# EasyEDA Pro project Mixed PCB_1.eprj

# Schematic Part1

## Sheets
1 P1: Create Date: 2024-04-20; Page Name: P1; Project Name: Mixed PCB; Schematic Name: Part1; Update Date: 2024-04-20; Company: EasyEDA.com; Drawn: EasyEDA; Page Size: A4; Part Number: JLCPCB-002; Reviewed: EasyEDA; Version: V0.1
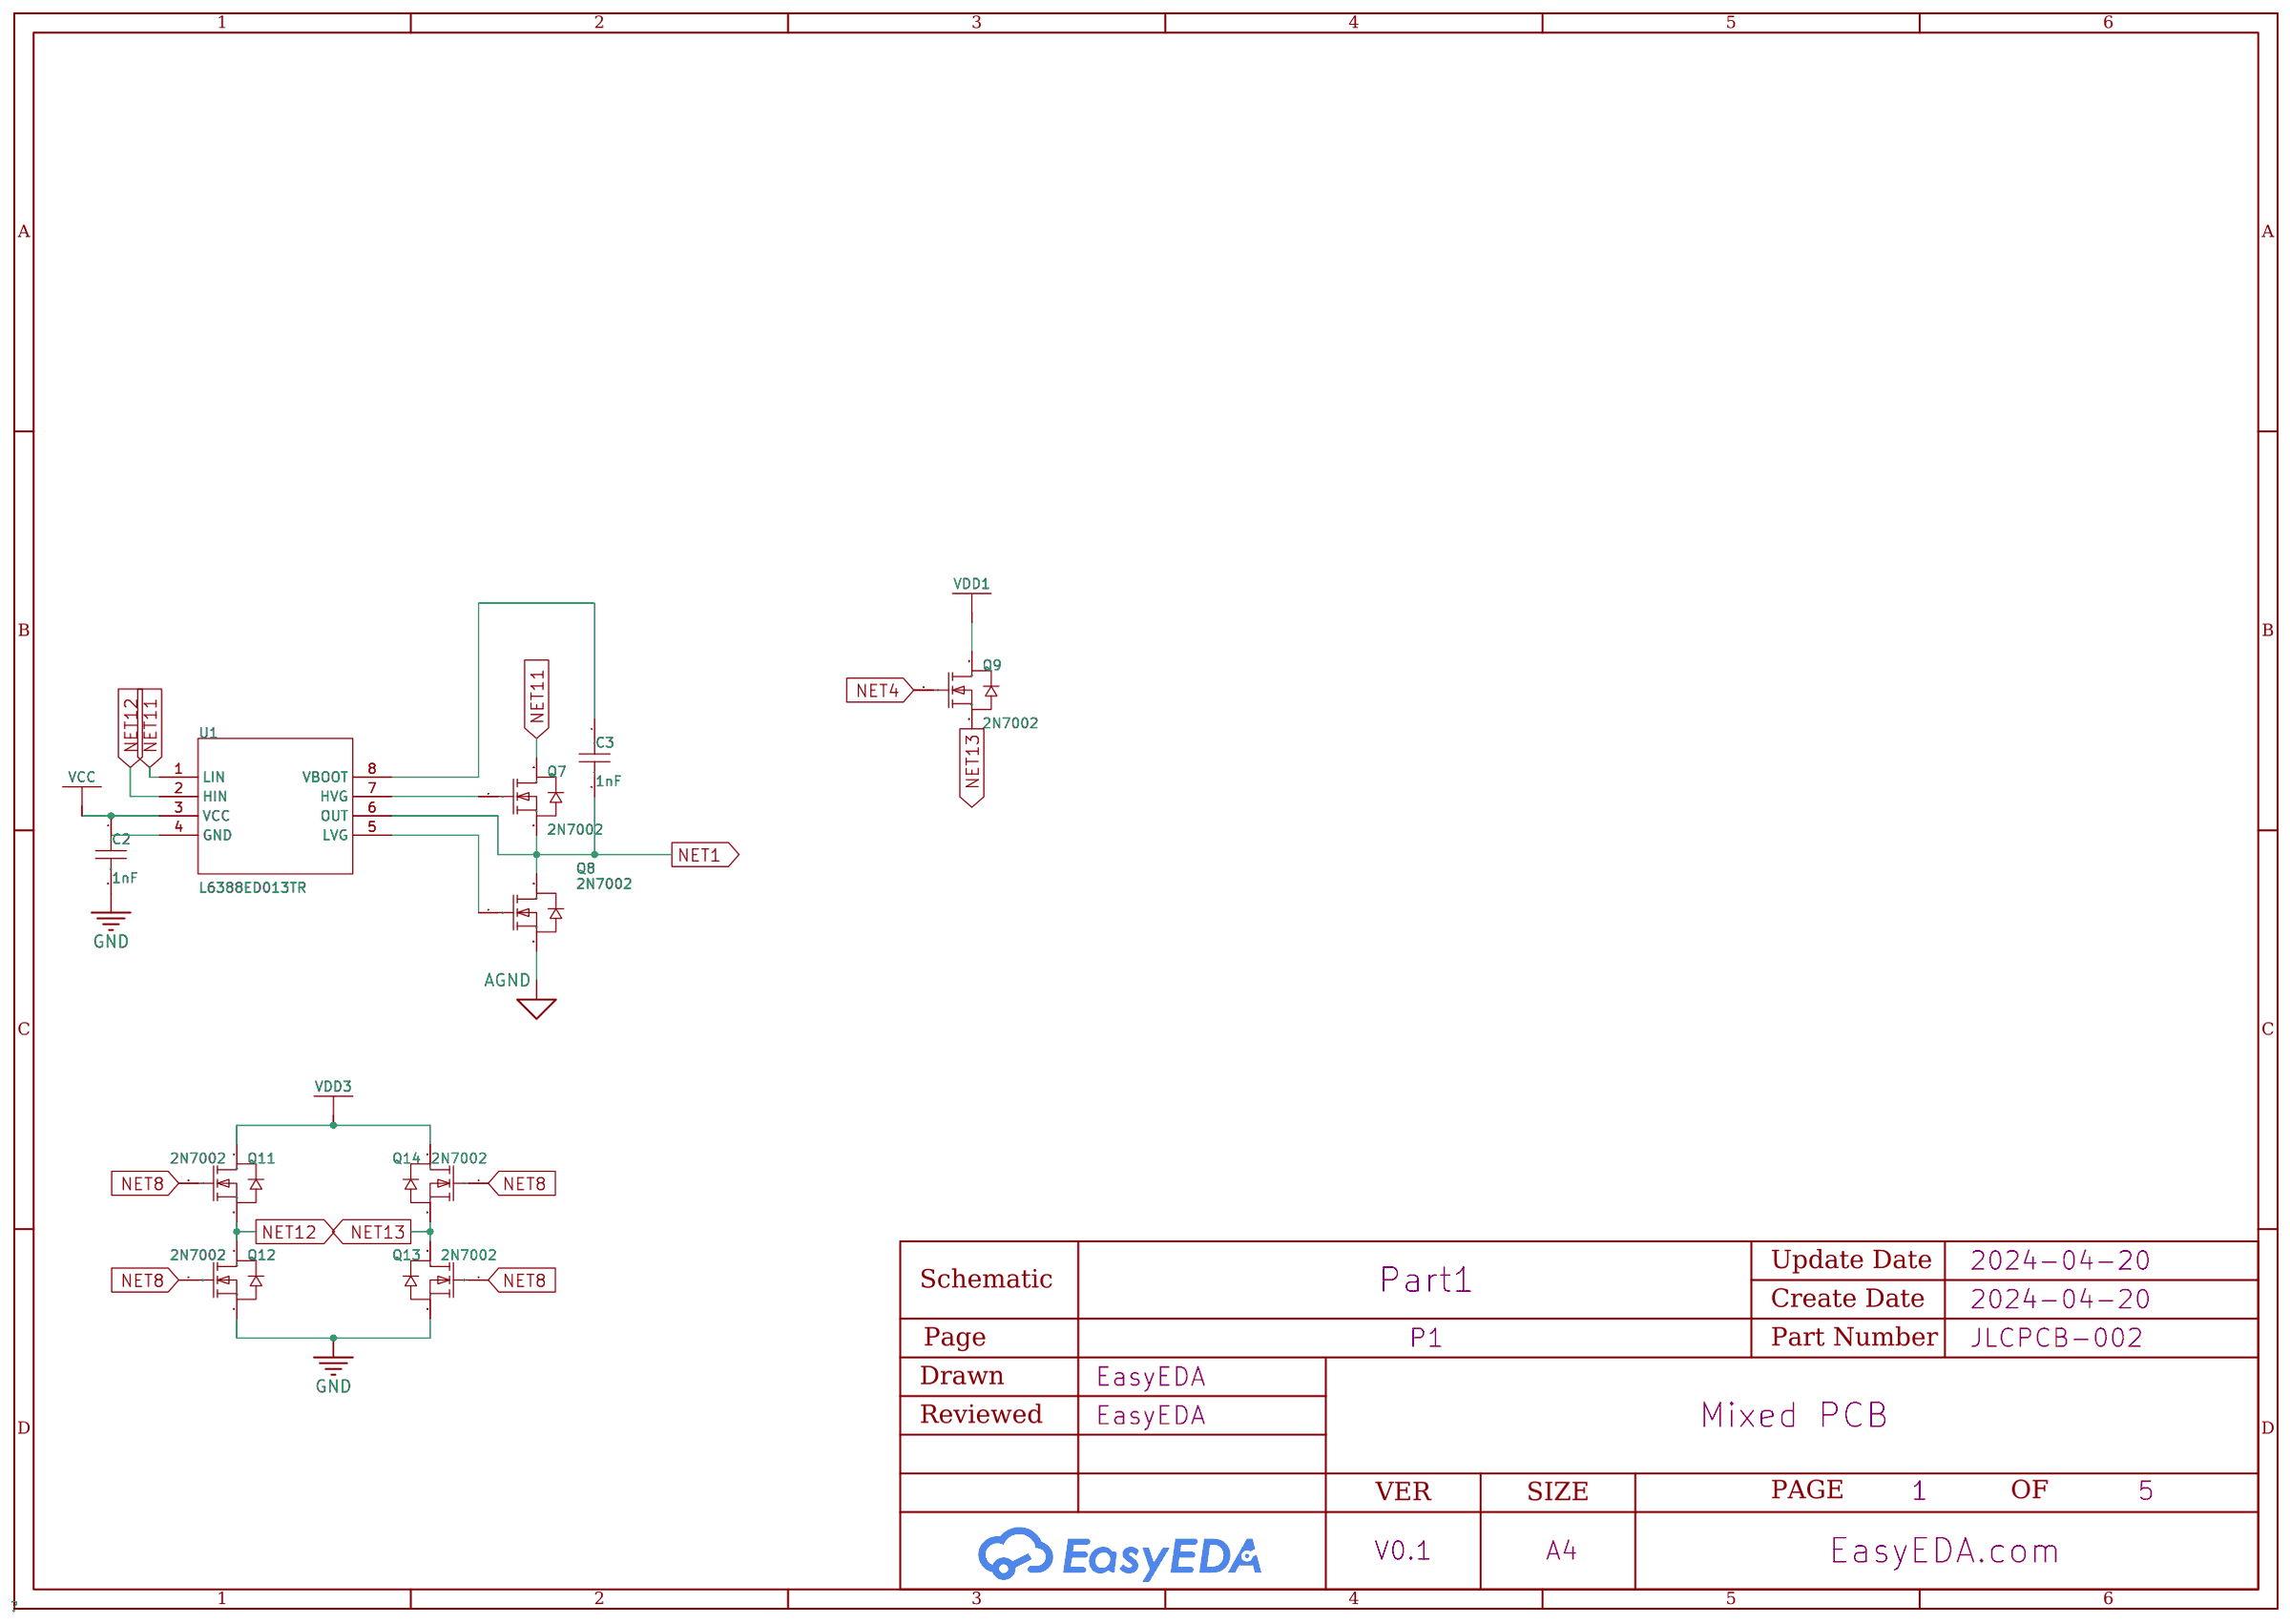
[diagram p0: P1]
2 P2: Page Name: P2
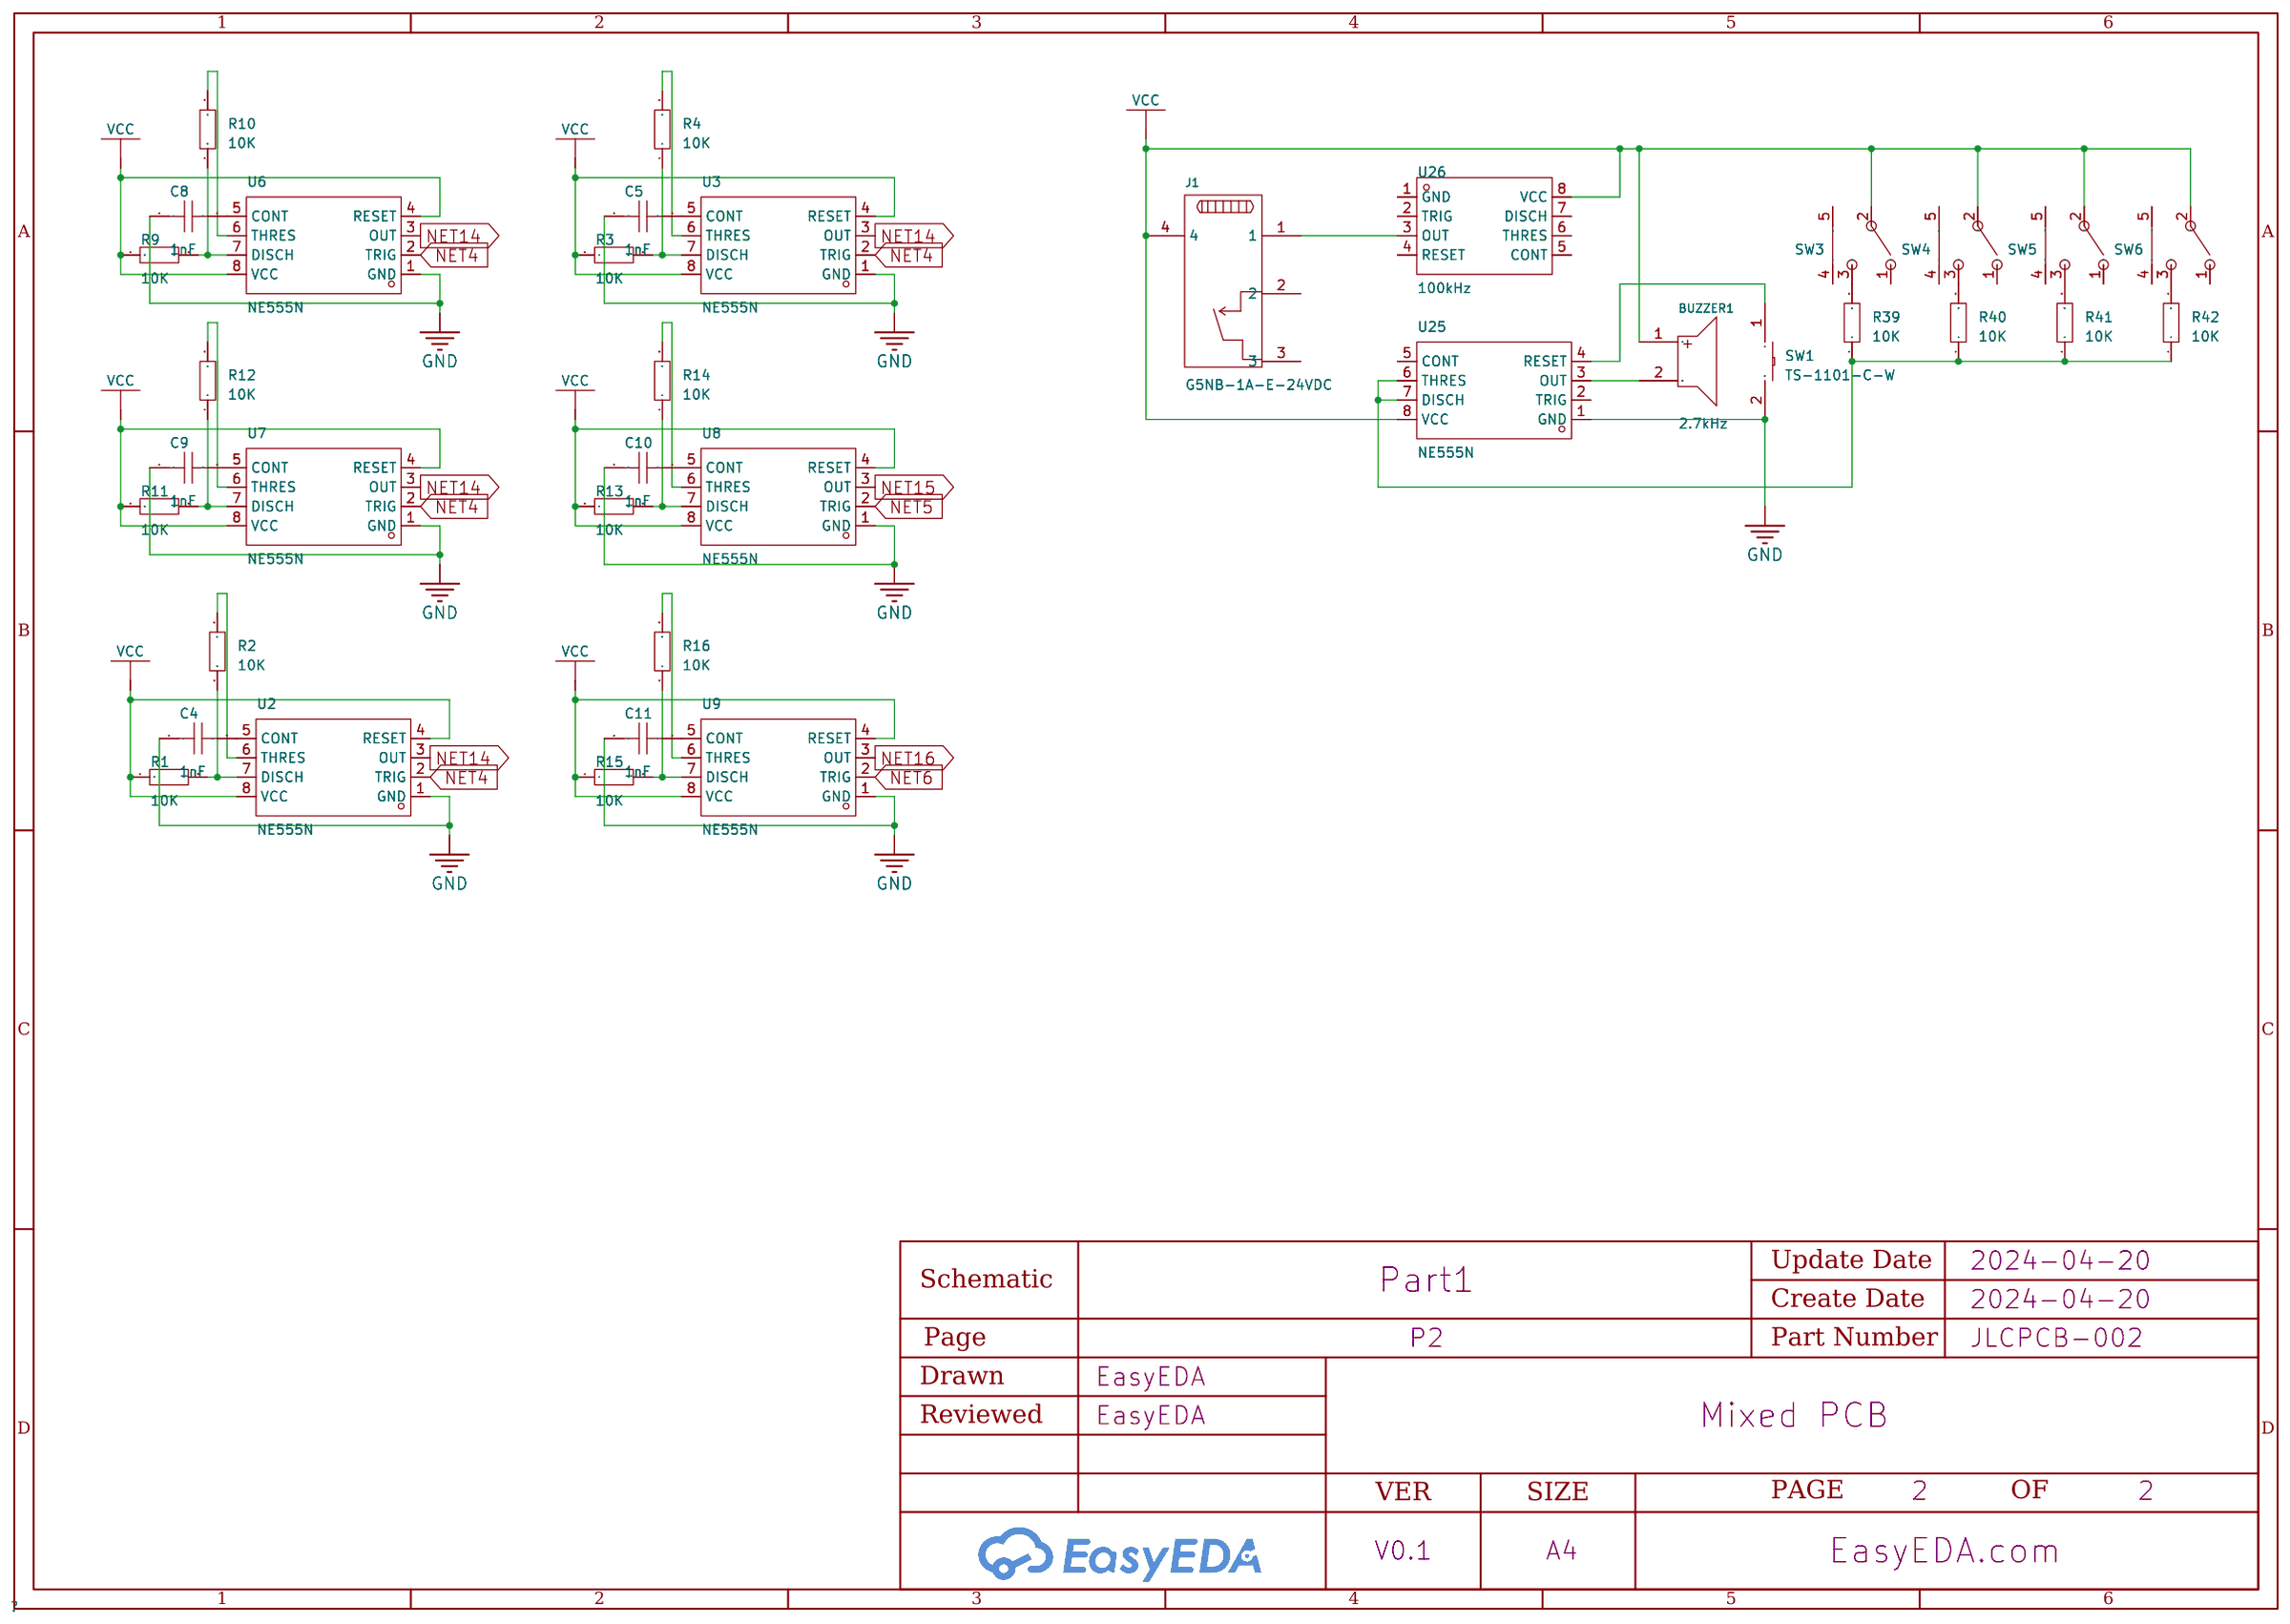
[diagram p1: P2]
3 P3: Page Name: P3
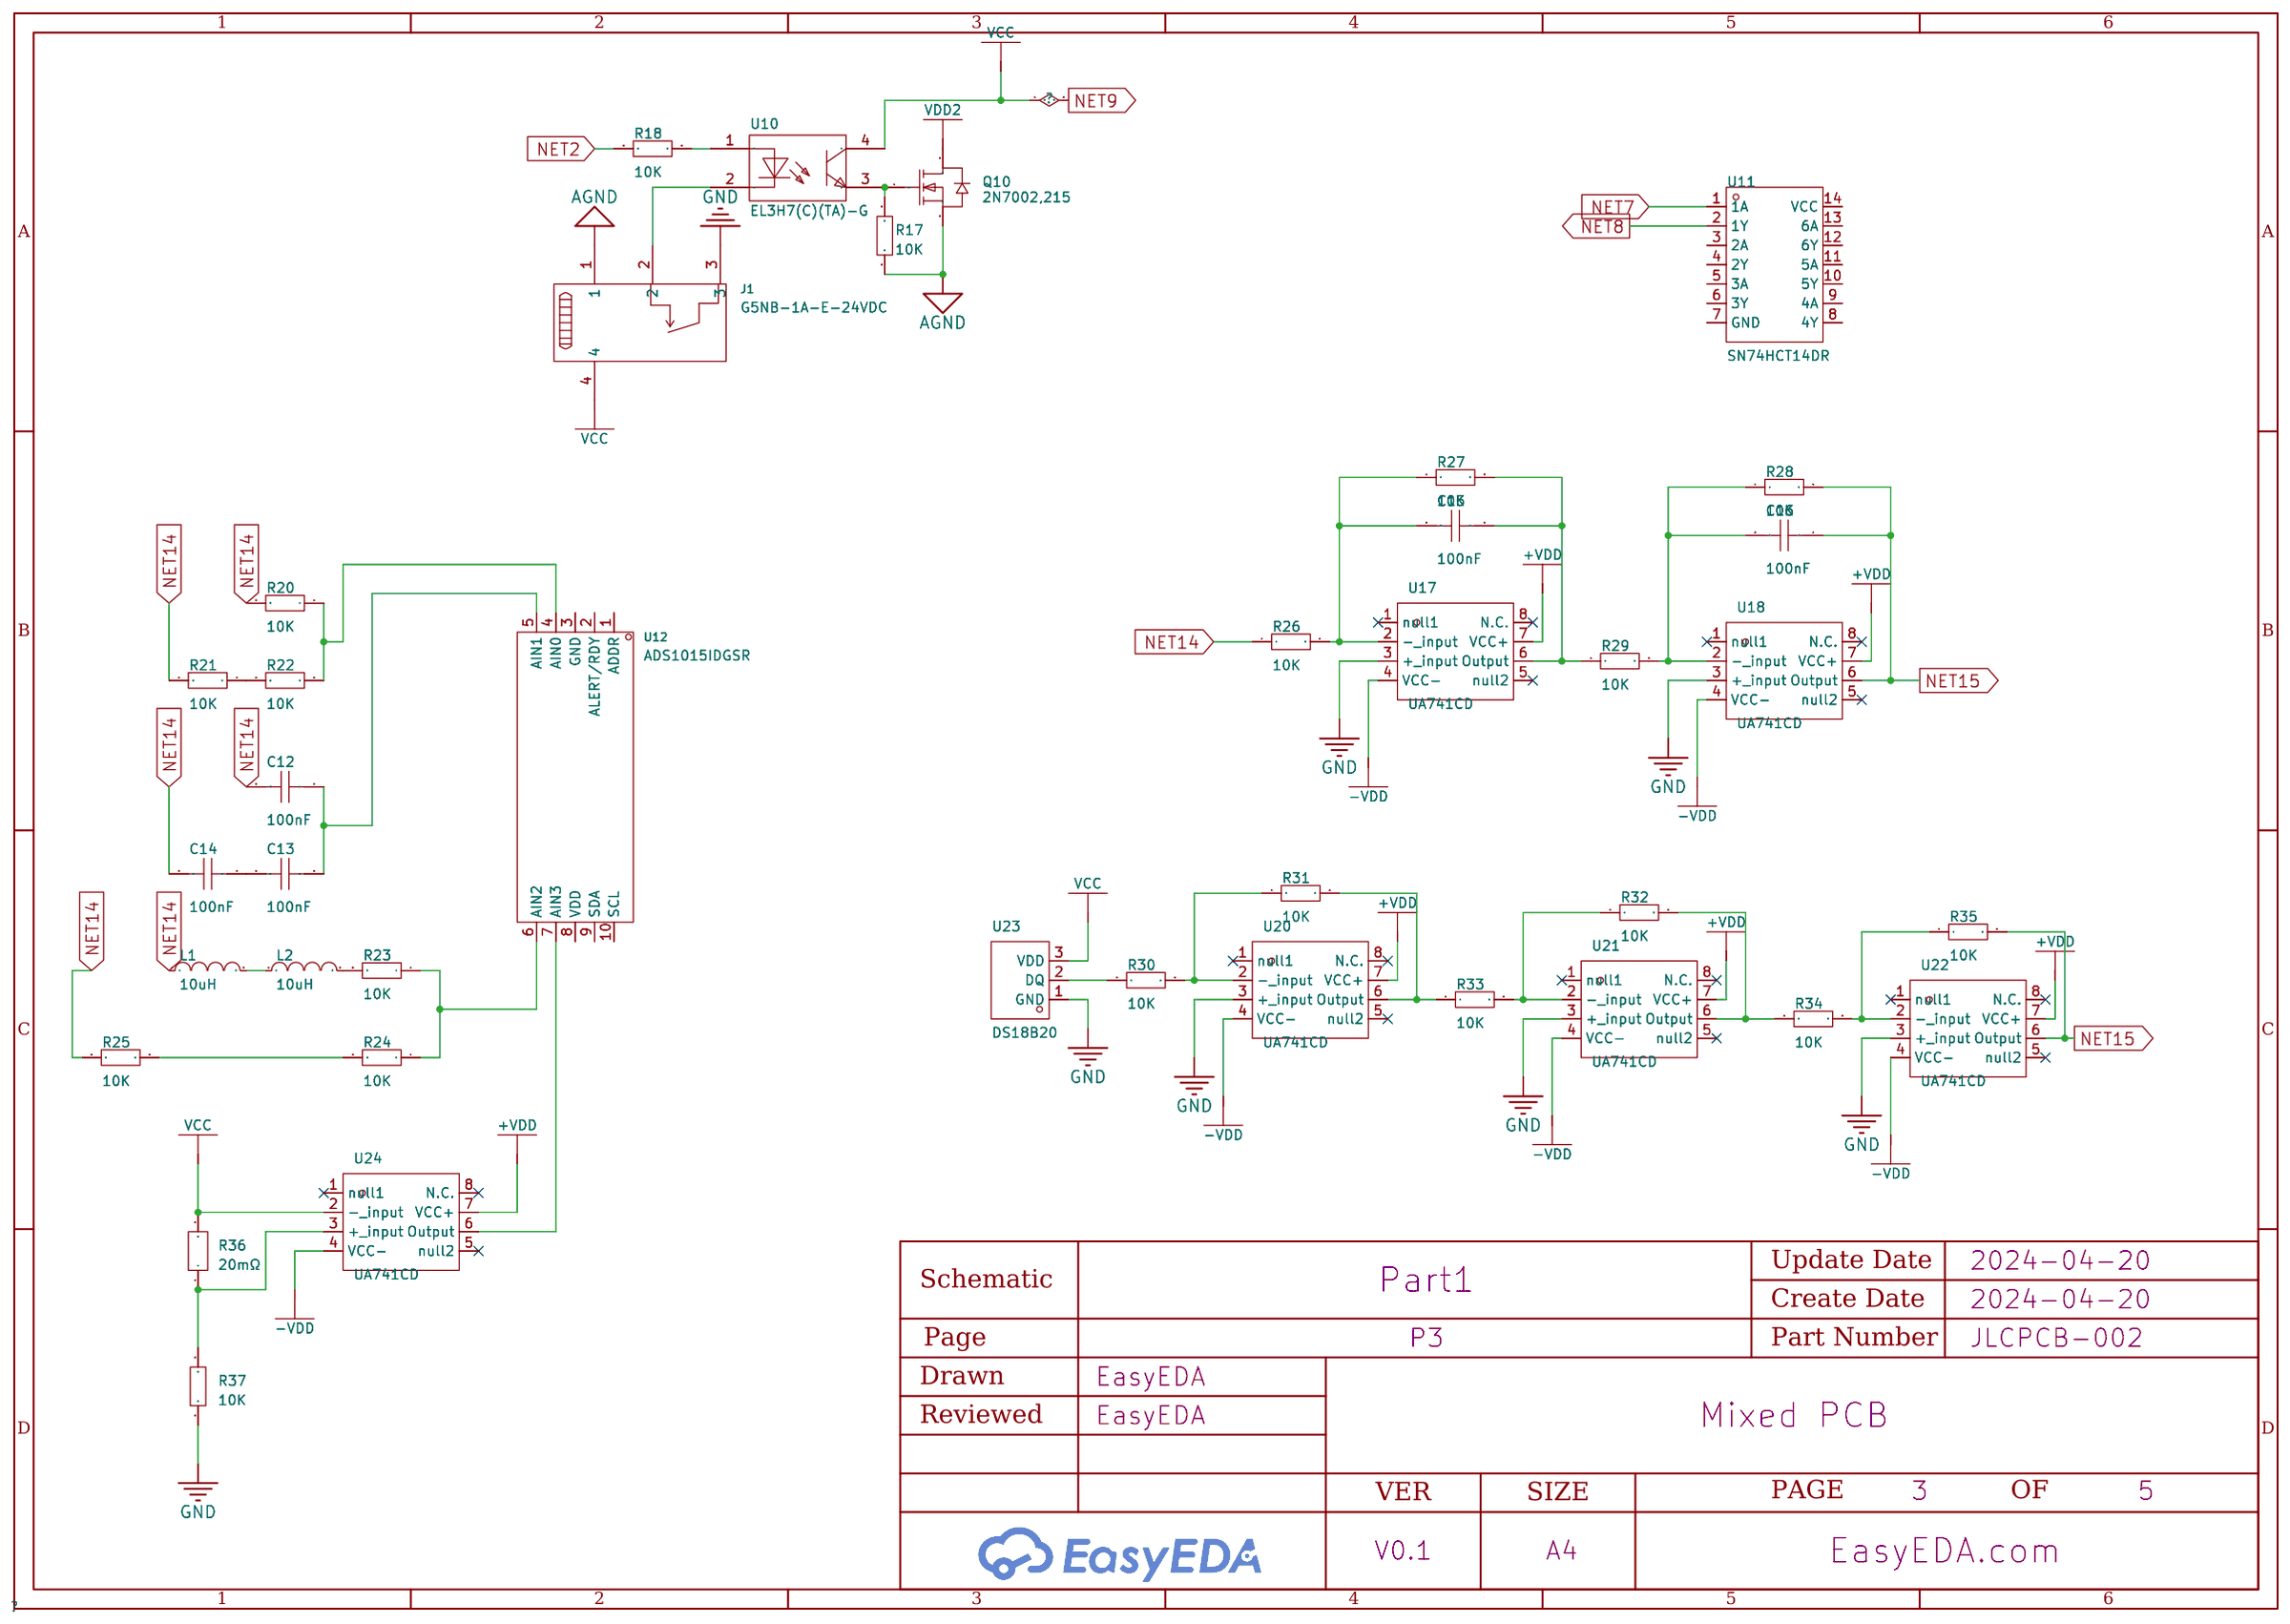
[diagram p2: P3]
4 P5: Page Name: P5.Part1; Update Date: 2024-04-24
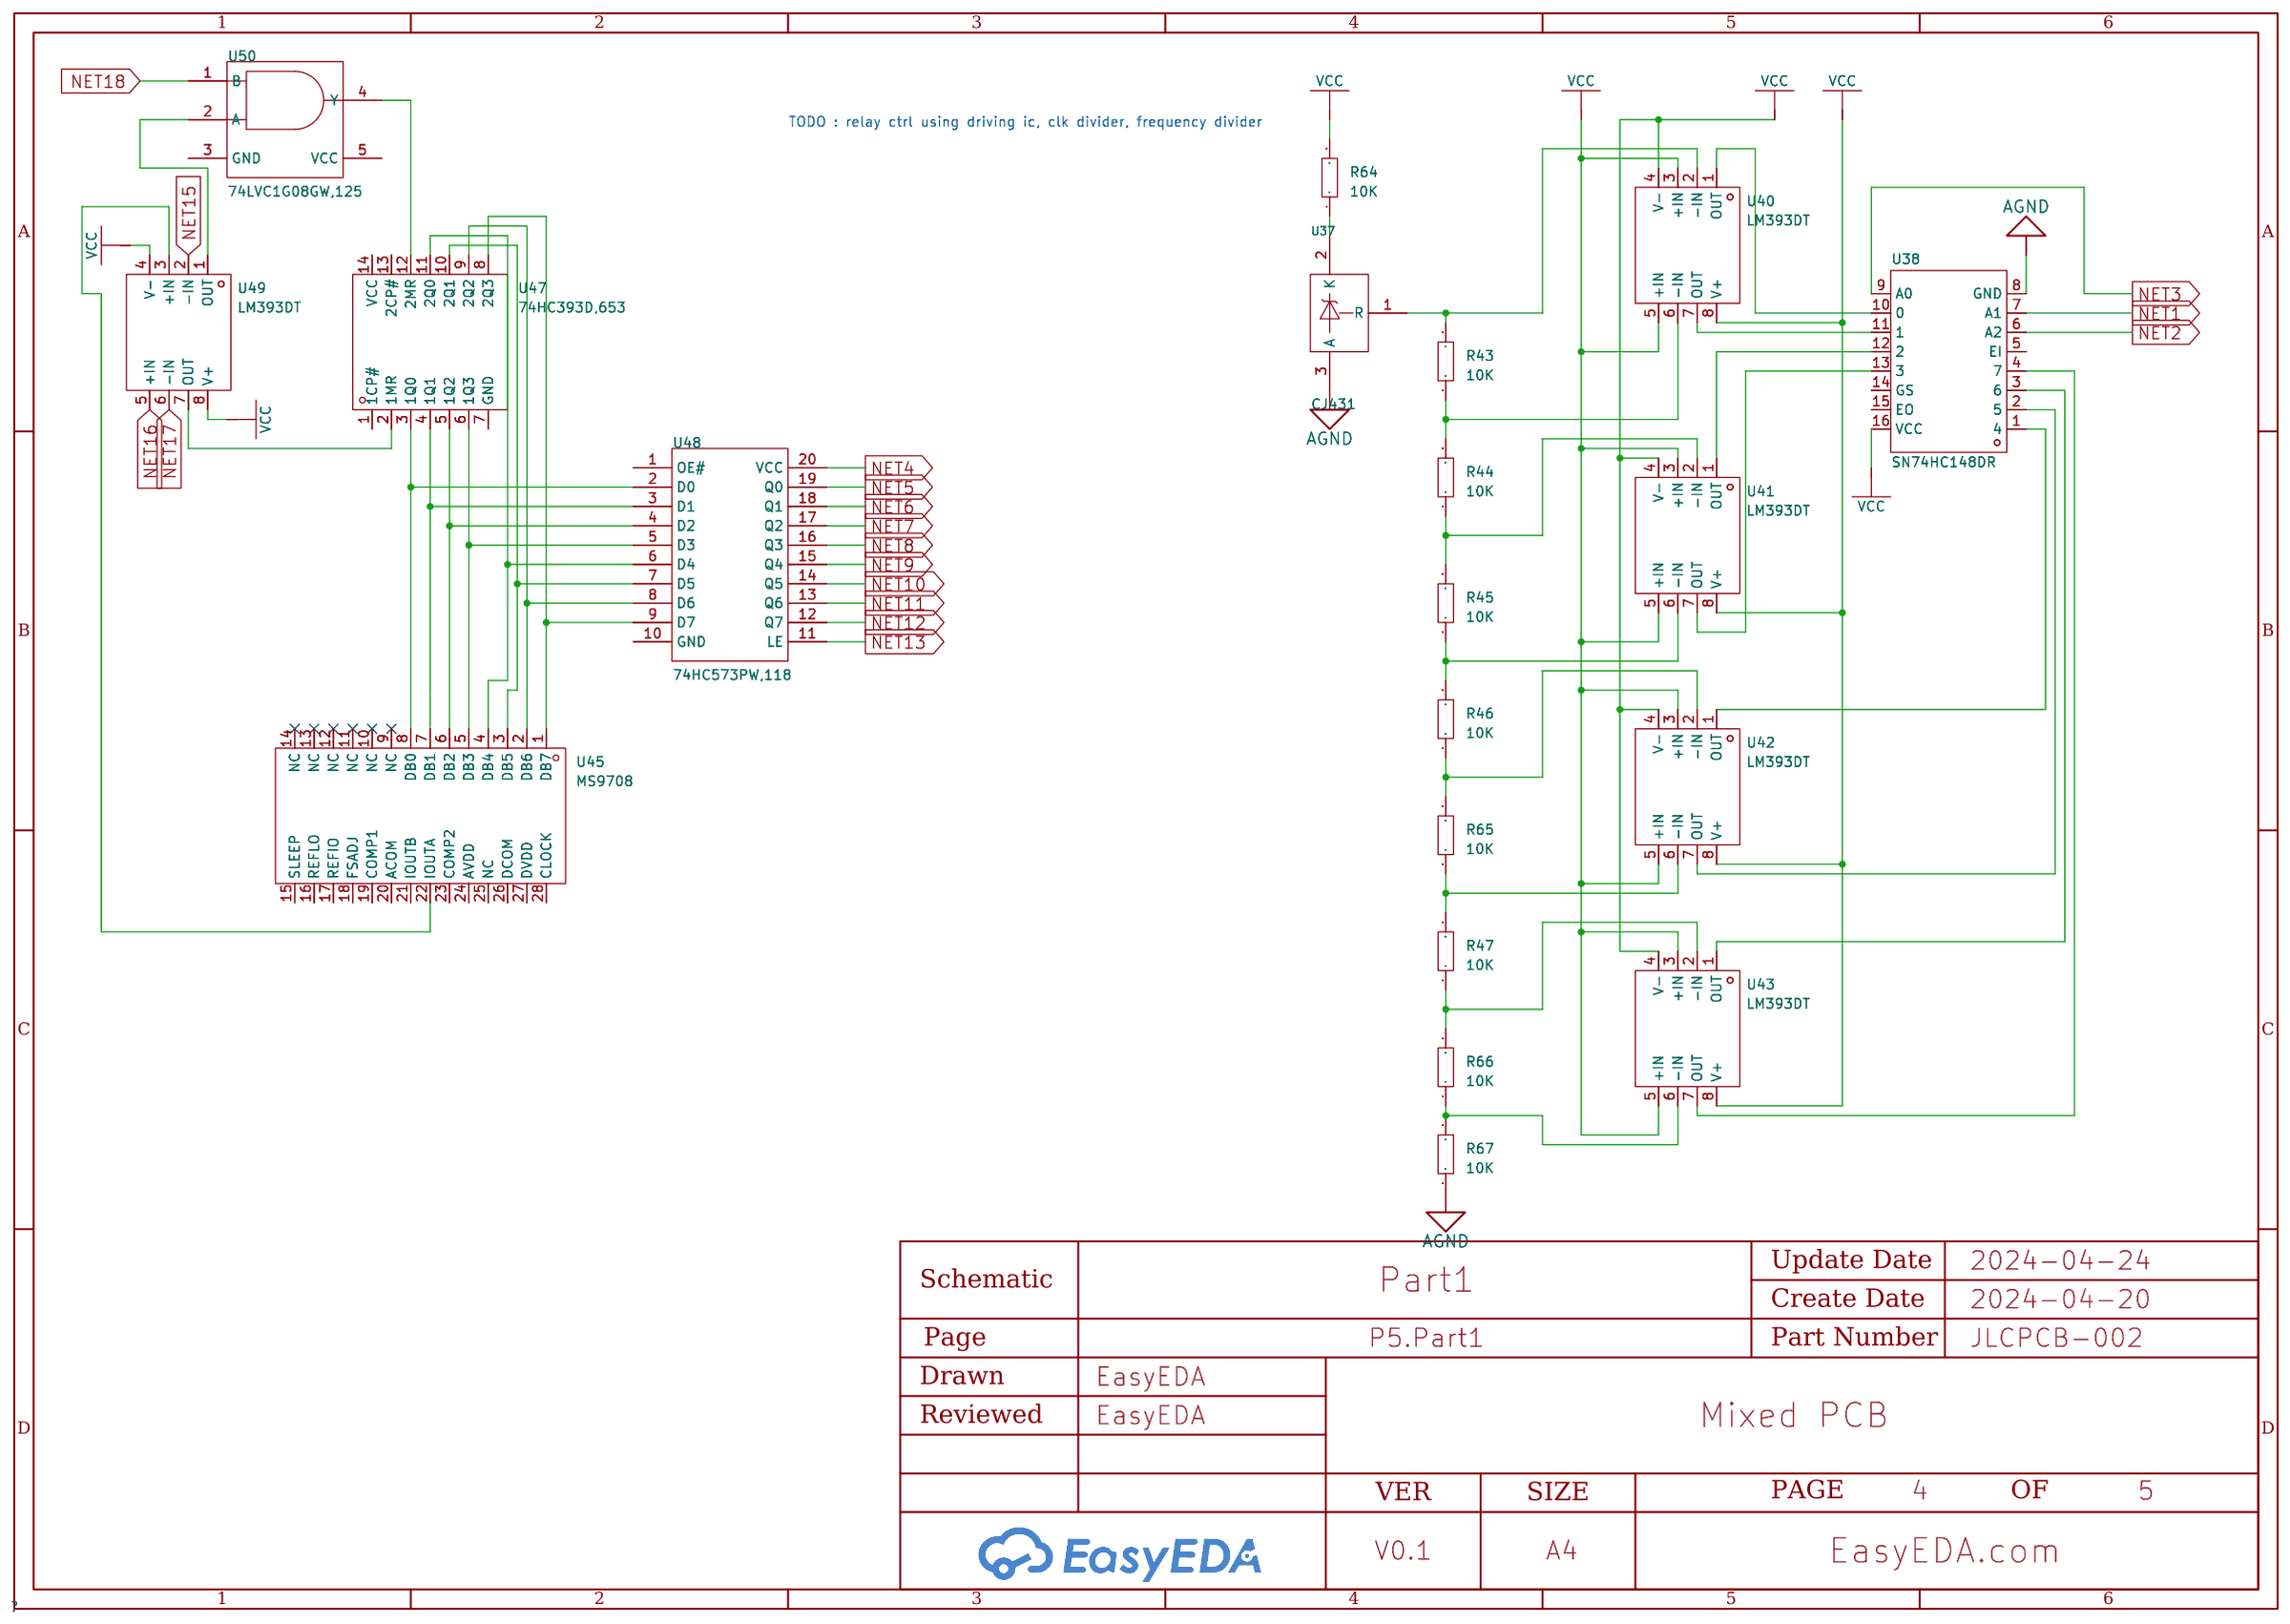
[diagram p3: P5]
5 P6: Create Date: 2024-04-23; Page Name: P6; Update Date: 2024-04-23
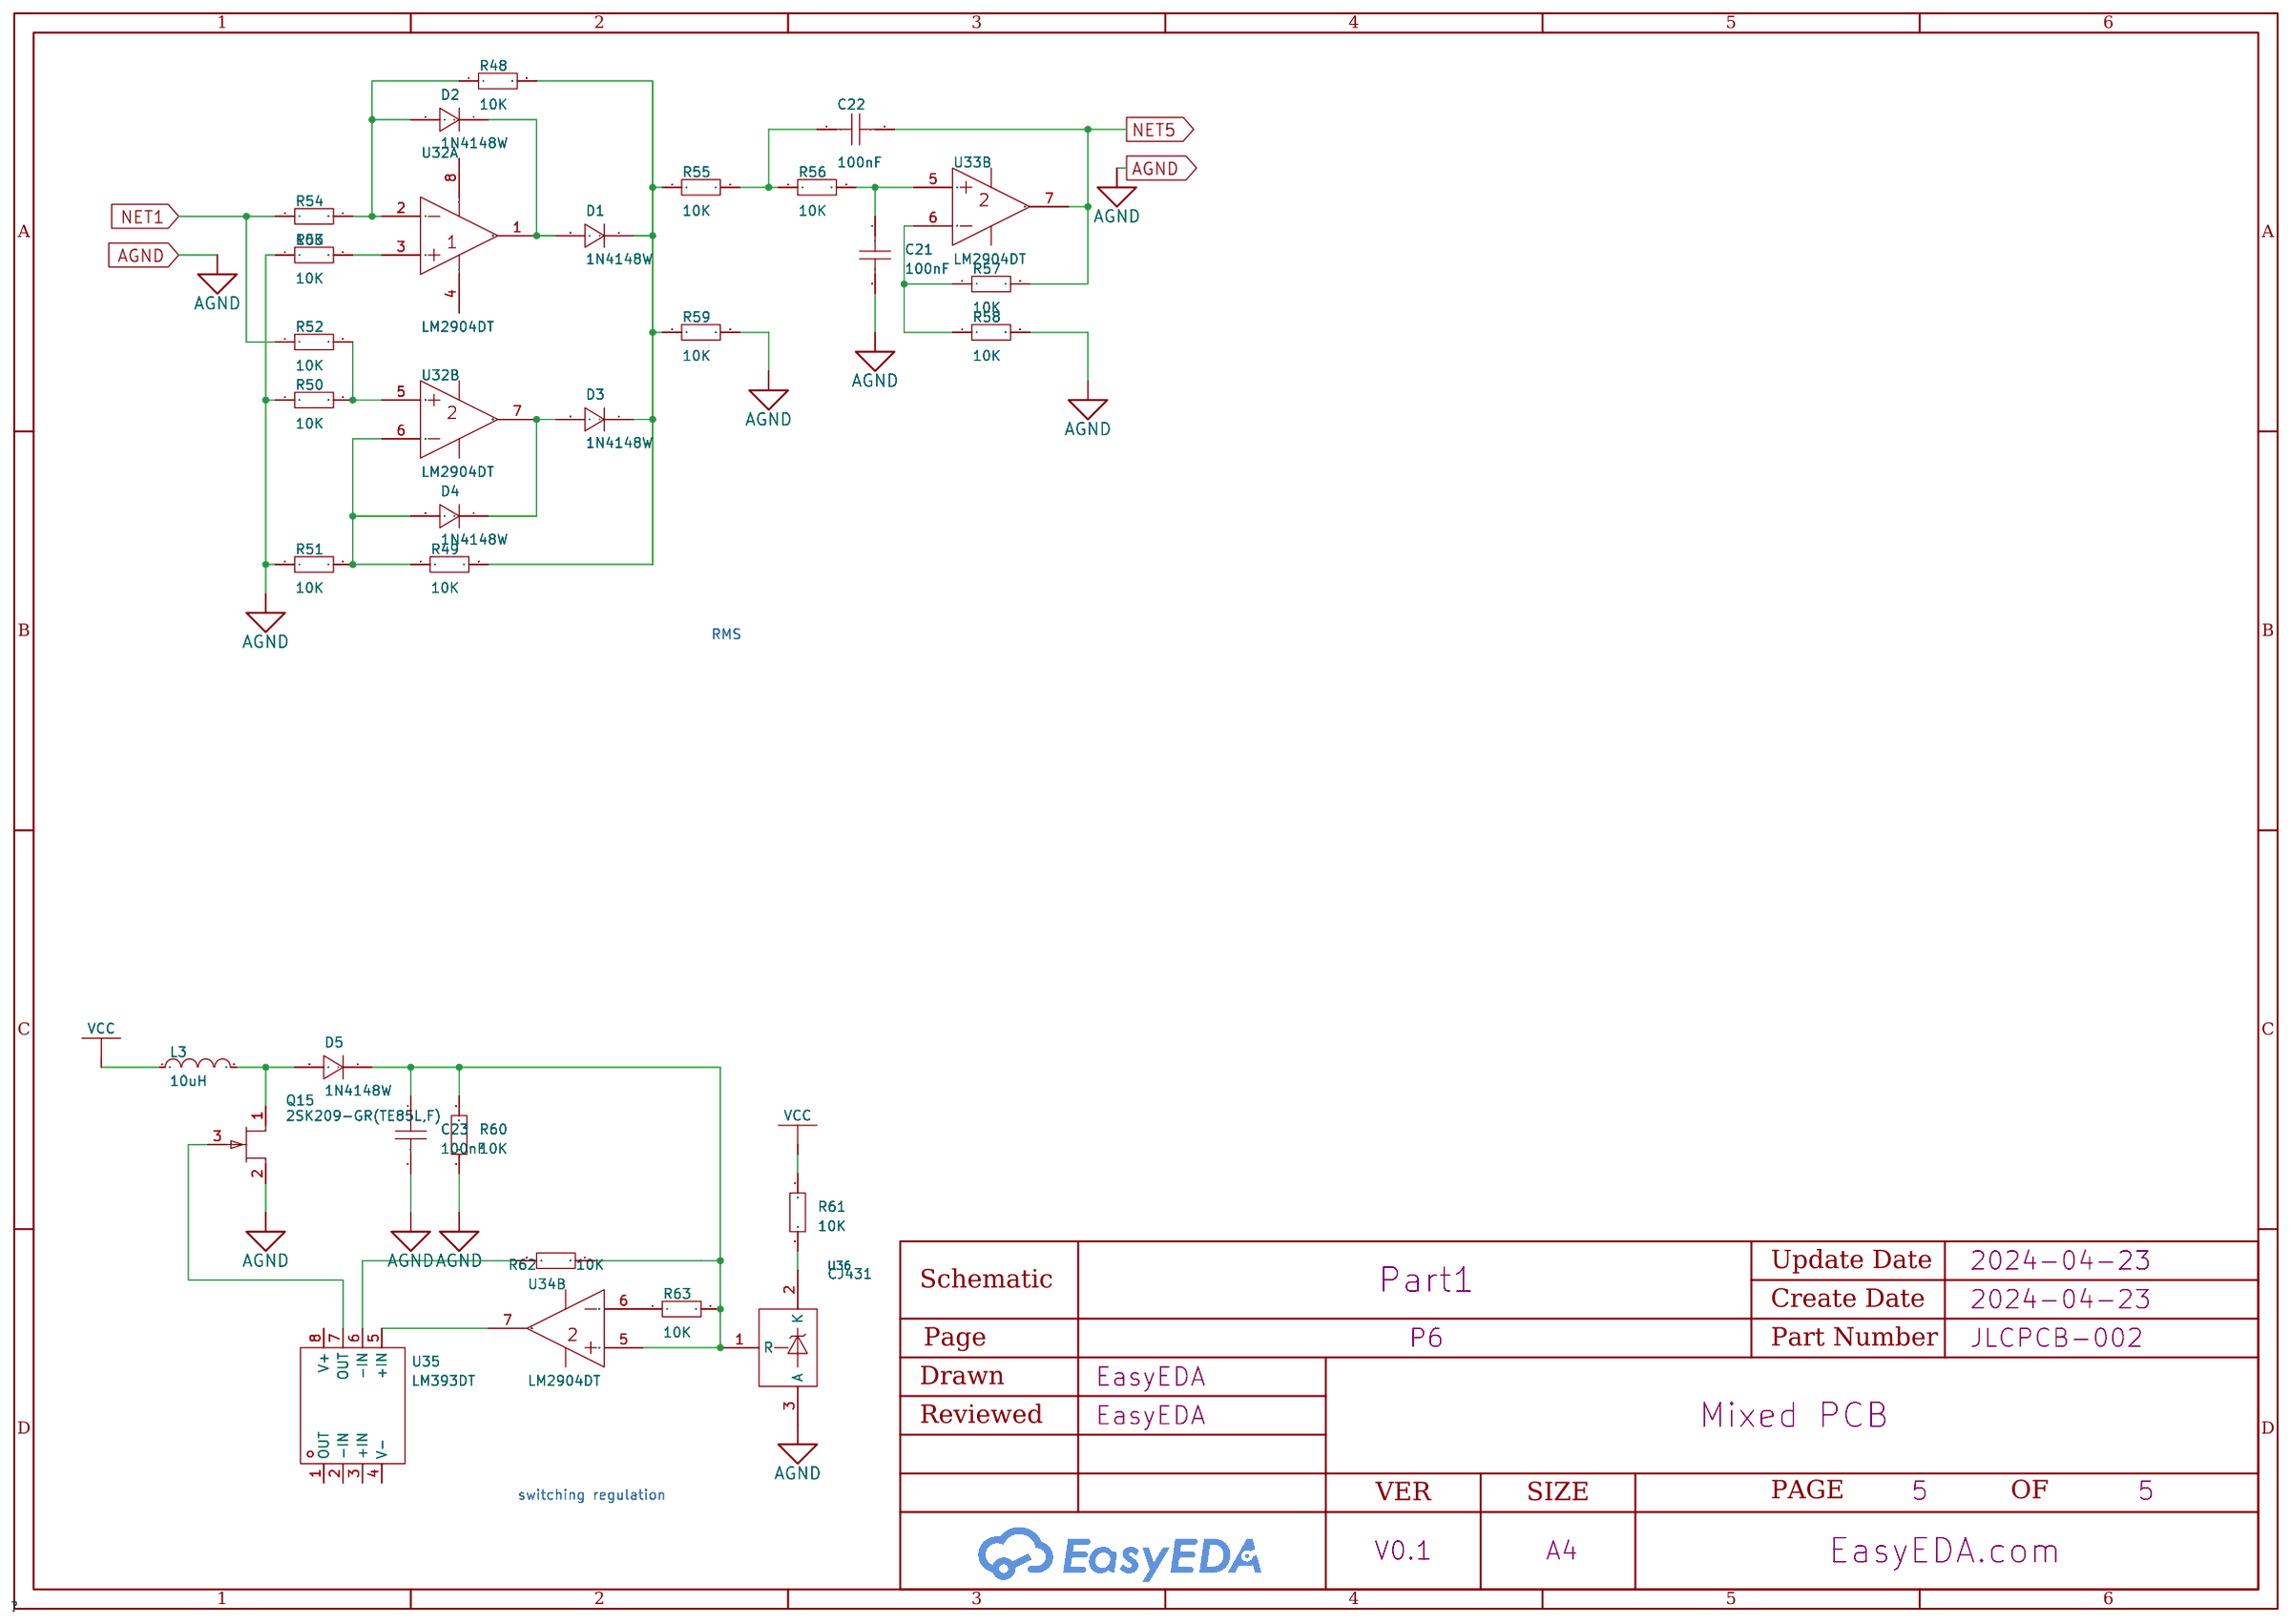
[diagram p4: P6]
6 P8: Create Date: 2024-04-26; Page Name: P8; Update Date: 2024-04-27
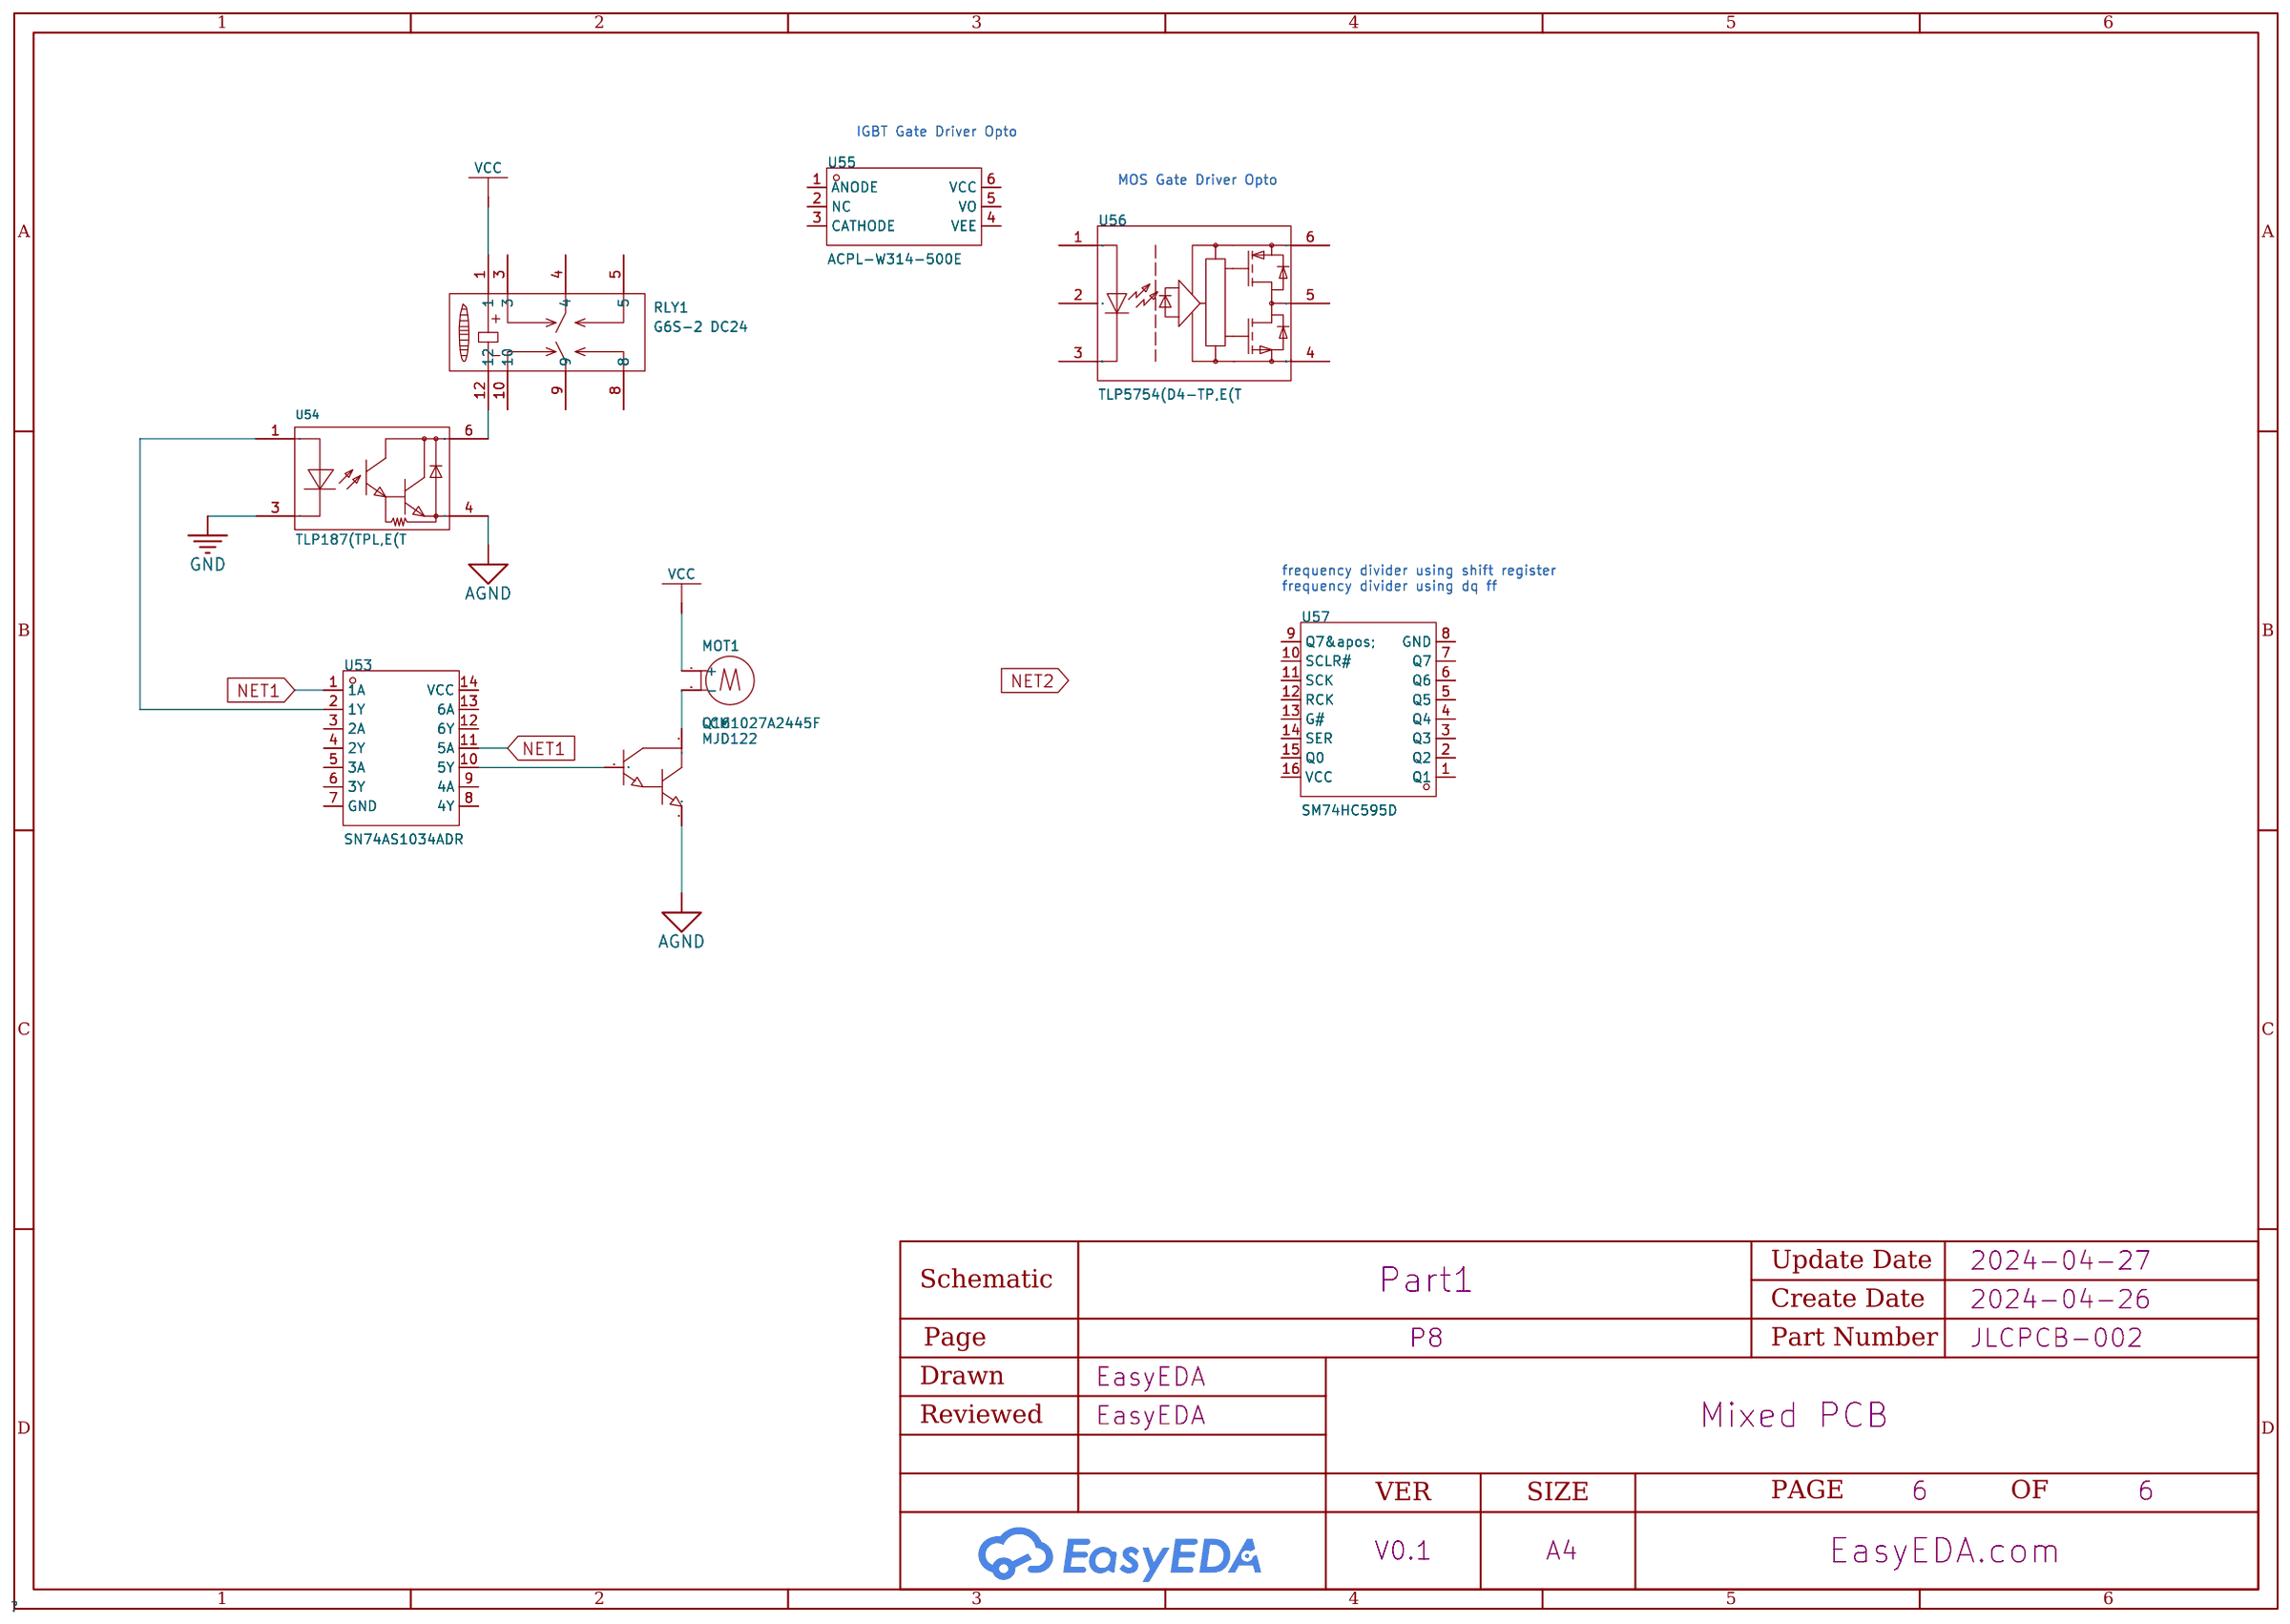
[diagram p5: P8]
7 P9: Create Date: 2024-04-28; Page Name: P9; Update Date: 2024-04-28
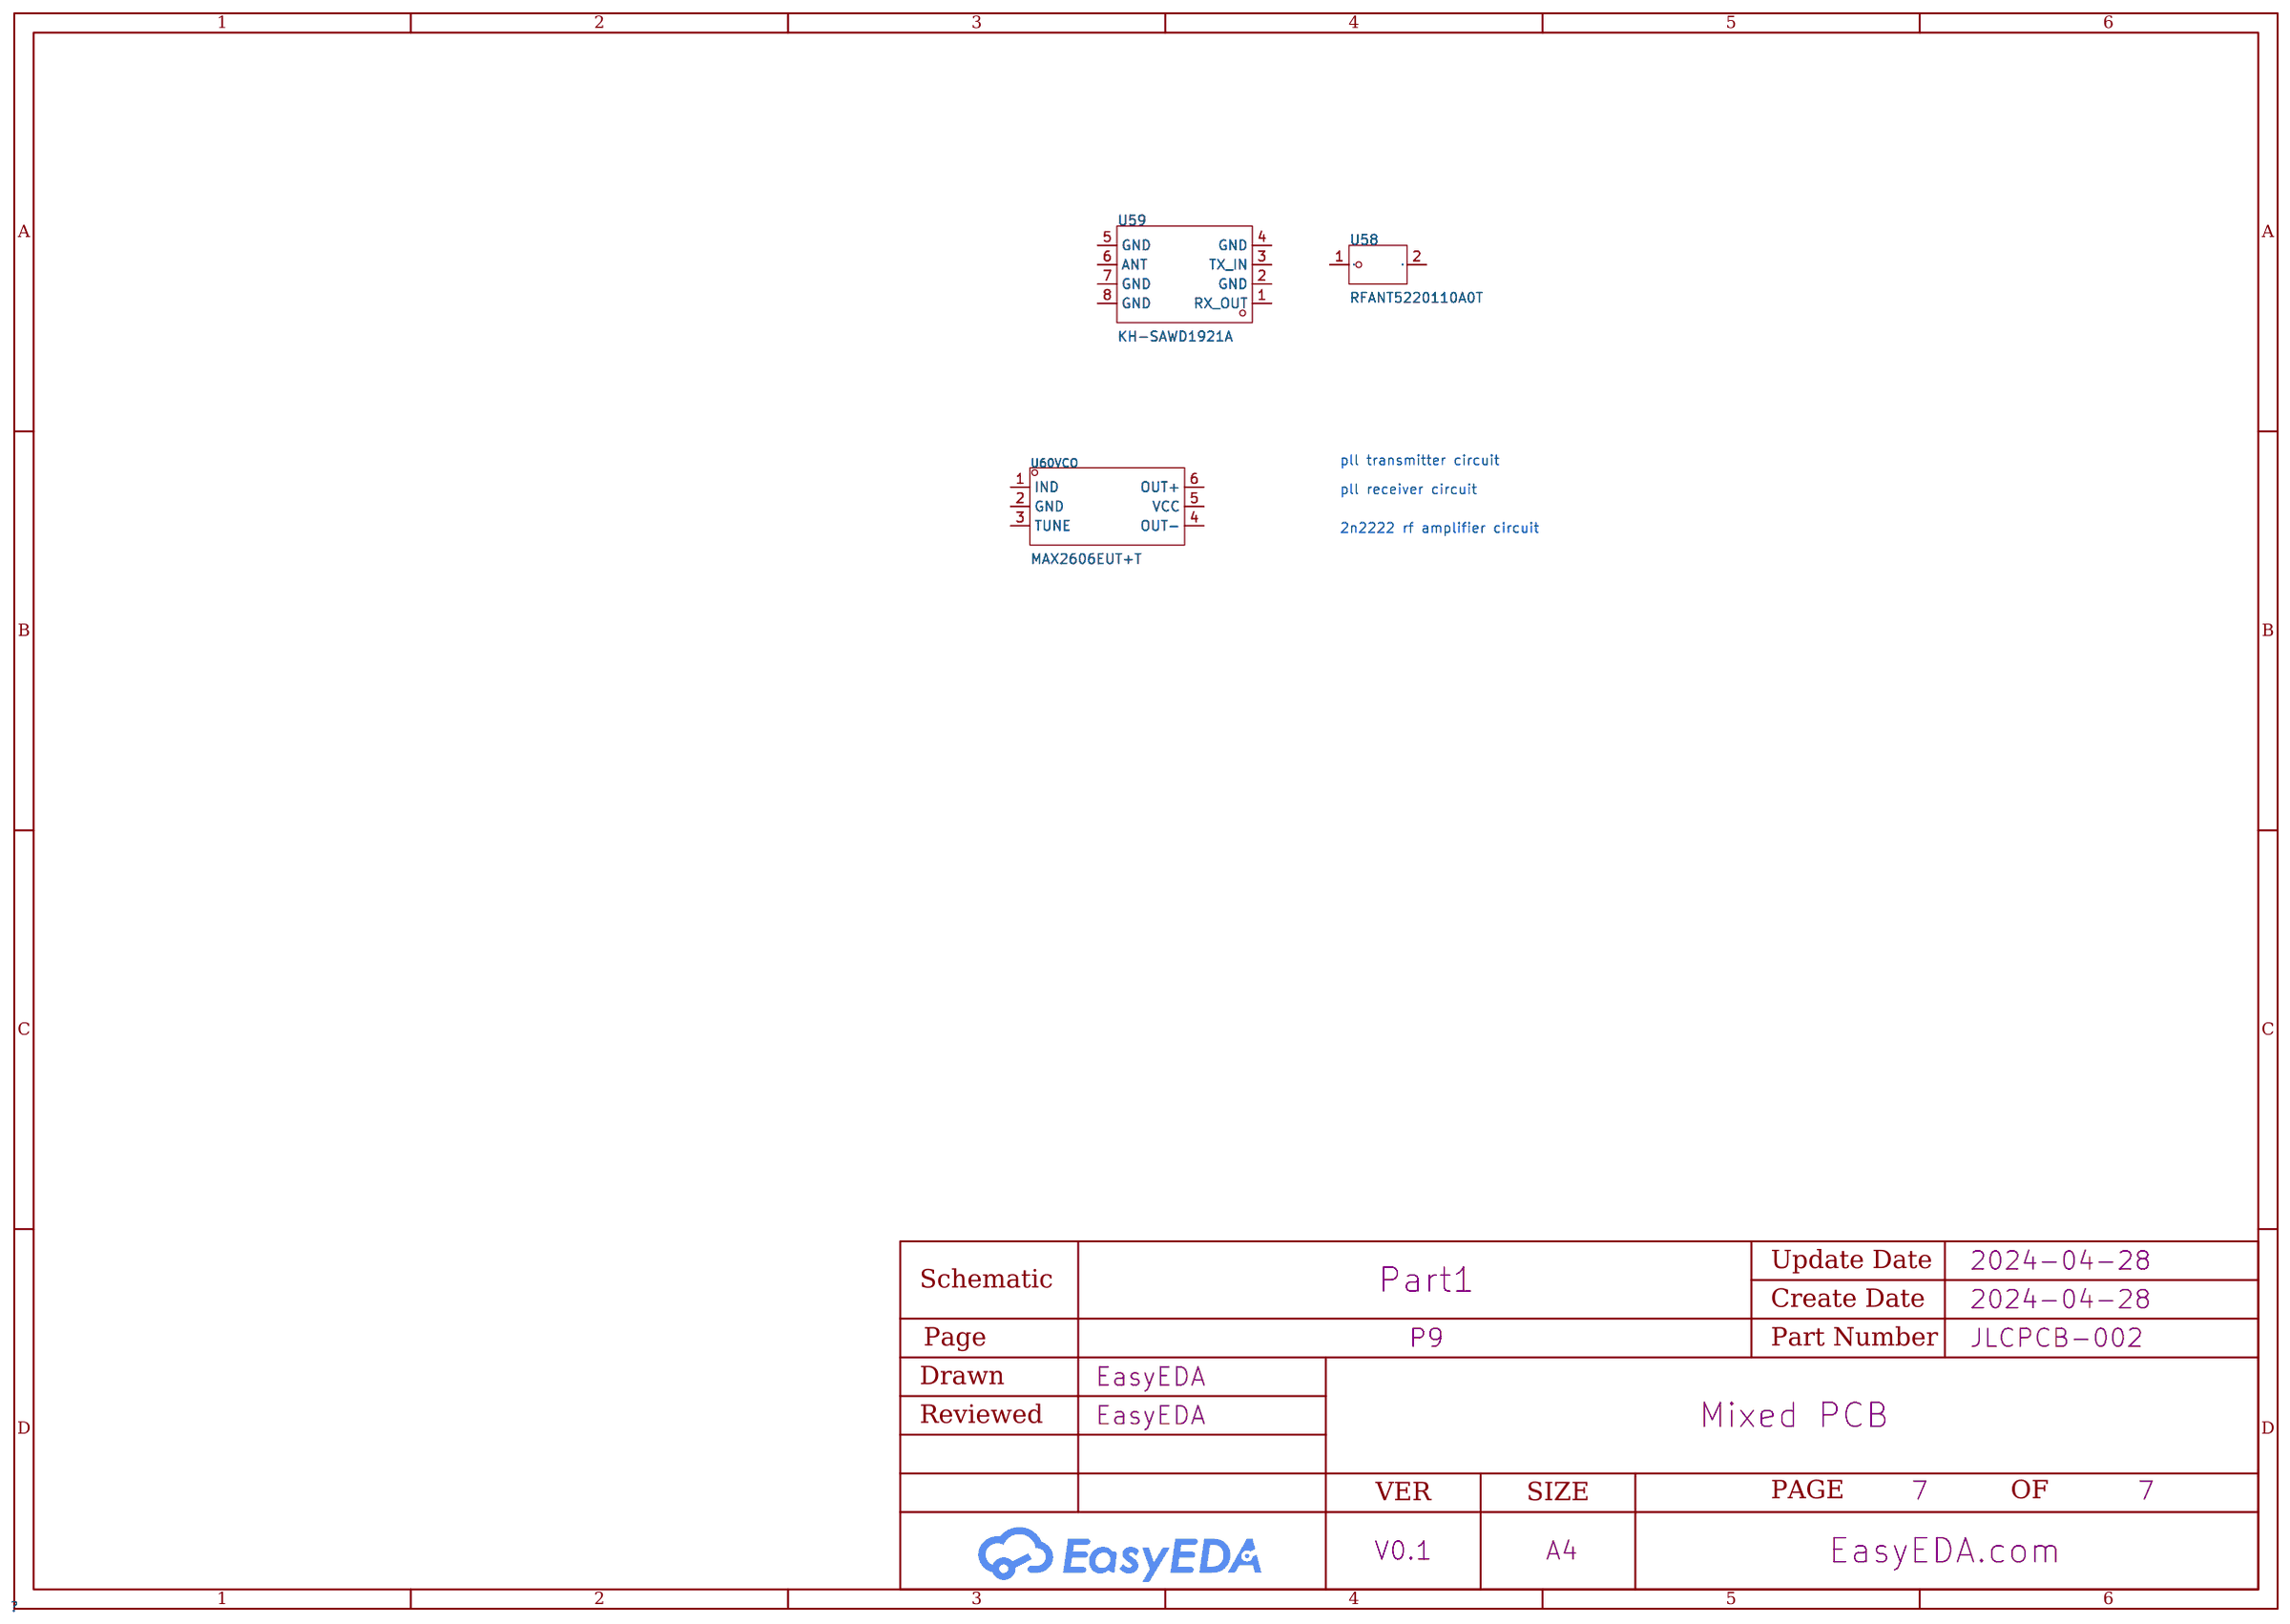
[diagram p6: P9]

## Parts
sheet P1
C2  1nF  [C0603]
C3  1nF  [C0603]
Q7  2N7002  [SOT-23-3_L2.9-W1.3-P1.90-LS2.4-BR]
Q8  2N7002  [SOT-23-3_L2.9-W1.3-P1.90-LS2.4-BR]
Q9  2N7002  [SOT-23-3_L2.9-W1.3-P1.90-LS2.4-BR]
Q11  2N7002  [SOT-23-3_L2.9-W1.3-P1.90-LS2.4-BR]
Q12  2N7002  [SOT-23-3_L2.9-W1.3-P1.90-LS2.4-BR]
Q13  2N7002  [SOT-23-3_L2.9-W1.3-P1.90-LS2.4-BR]
Q14  2N7002  [SOT-23-3_L2.9-W1.3-P1.90-LS2.4-BR]
U1  L6388ED013TR  [SOIC-8_L5.0-W4.0-P1.27-LS6.0-BL]
sheet P2
BUZZER1  2.7kHz  [BUZ-TH_BD9.0-P4.00-D0.6-FD]
C4  1nF  [C0603]
C5  1nF  [C0603]
C8  1nF  [C0603]
C9  1nF  [C0603]
C10  1nF  [C0603]
C11  1nF  [C0603]
J1  G5NB-1A-E-24VDC  [RELAY-TH_G5NB-1A-E-24VDC]
R1  10K  [R0603]
R2  10K  [R0603]
R3  10K  [R0603]
R4  10K  [R0603]
R9  10K  [R0603]
R10  10K  [R0603]
R11  10K  [R0603]
R12  10K  [R0603]
R13  10K  [R0603]
R14  10K  [R0603]
R15  10K  [R0603]
R16  10K  [R0603]
R39  10K  [R0603]
R40  10K  [R0603]
R41  10K  [R0603]
R42  10K  [R0603]
SW1  TS-1101-C-W  [SW-SMD_L6.0-W3.3-LS8.0]
SW3  ST-0-102-C03-N003-RS  [SW-TH_ST-0-102-C03-N003-RS]
SW4  ST-0-102-C03-N003-RS  [SW-TH_ST-0-102-C03-N003-RS]
SW5  ST-0-102-C03-N003-RS  [SW-TH_ST-0-102-C03-N003-RS]
SW6  ST-0-102-C03-N003-RS  [SW-TH_ST-0-102-C03-N003-RS]
U2  NE555N  [DIP-8_L9.8-W6.6-P2.54-LS7.6-BL]
U3  NE555N  [DIP-8_L9.8-W6.6-P2.54-LS7.6-BL]
U6  NE555N  [DIP-8_L9.8-W6.6-P2.54-LS7.6-BL]
U7  NE555N  [DIP-8_L9.8-W6.6-P2.54-LS7.6-BL]
U8  NE555N  [DIP-8_L9.8-W6.6-P2.54-LS7.6-BL]
U9  NE555N  [DIP-8_L9.8-W6.6-P2.54-LS7.6-BL]
U25  NE555N  [DIP-8_L9.8-W6.6-P2.54-LS7.6-BL]
U26  100kHz  [DIP-8_L9.8-W6.6-P2.54-LS7.6-BL]
sheet P3
C12  100nF  [C0603]
C13  100nF  [C0603]
C14  100nF  [C0603]
C15  100nF  [C0603]
C16  100nF  [C0603]
J1#2  G5NB-1A-E-24VDC  [RELAY-TH_G5NB-1A-E-24VDC]
L1  10uH  [L0603]
L2  10uH  [L0603]
Q10  2N7002,215  [SOT-23_L2.9-W1.3-P1.90-LS2.4-BR]
R17  10K  [R0603]
R18  10K  [R0603]
R20  10K  [R0603]
R21  10K  [R0603]
R22  10K  [R0603]
R23  10K  [R0603]
R24  10K  [R0603]
R25  10K  [R0603]
R26  10K  [R0603]
R27  10K  [R0603]
R28  10K  [R0603]
R29  10K  [R0603]
R30  10K  [R0603]
R31  10K  [R0603]
R32  10K  [R0603]
R33  10K  [R0603]
R34  10K  [R0603]
R35  10K  [R0603]
R36  20mΩ  [R1206]
R37  10K  [R0603]
U10  EL3H7(C)(TA)-G  [SMD-4_L2.7-W4.4-P1.27-LS7.0-BL]
U11  SN74HCT14DR  [SOIC-14_L8.7-W3.9-P1.27-LS6.0-BL]
U12  ADS1015IDGSR  [VSSOP-10_L3.0-W3.0-P0.50-LS4.9-BL]
U17  UA741CD  [SO-8_L4.9-W3.9-P1.27-LS6.0-BL]
U18  UA741CD  [SO-8_L4.9-W3.9-P1.27-LS6.0-BL]
U20  UA741CD  [SO-8_L4.9-W3.9-P1.27-LS6.0-BL]
U21  UA741CD  [SO-8_L4.9-W3.9-P1.27-LS6.0-BL]
U22  UA741CD  [SO-8_L4.9-W3.9-P1.27-LS6.0-BL]
U23  DS18B20  [TO-92-3_L4.9-W3.7-P1.27-L]
U24  UA741CD  [SO-8_L4.9-W3.9-P1.27-LS6.0-BL]
sheet P5
R43  10K  [R0603]
R44  10K  [R0603]
R45  10K  [R0603]
R46  10K  [R0603]
R47  10K  [R0603]
R64  10K  [R0603]
R65  10K  [R0603]
R66  10K  [R0603]
R67  10K  [R0603]
U37  CJ431  [SOT-23-3_L2.9-W1.6-P1.90-LS2.8-BR]
U38  SN74HC148DR  [SOIC-16_L9.9-W3.9-P1.27-LS6.0-BL]
U40  LM393DT  [SOIC-8_L5.0-W4.0-P1.27-LS6.0-BL]
U41  LM393DT  [SOIC-8_L5.0-W4.0-P1.27-LS6.0-BL]
U42  LM393DT  [SOIC-8_L5.0-W4.0-P1.27-LS6.0-BL]
U43  LM393DT  [SOIC-8_L5.0-W4.0-P1.27-LS6.0-BL]
U45  MS9708  [TSSOP-28_L9.7-W4.4-P0.65-LS6.4-BL]
U47  74HC393D,653  [SOIC-14_L8.7-W3.9-P1.27-LS6.0-BL]
U48  74HC573PW,118  [TSSOP-20_L6.5-W4.4-P0.65-LS6.4-BL]
U49  LM393DT  [SOIC-8_L5.0-W4.0-P1.27-LS6.0-BL]
U50  74LVC1G08GW,125  [SOT-353_L2.1-W1.3-P0.65-LS2.3-BR]
sheet P6
C21  100nF  [C0603]
C22  100nF  [C0603]
C23  100nF  [C0603]
D1  1N4148W  [SOD-123_L2.7-W1.6-LS3.7-RD]
D2  1N4148W  [SOD-123_L2.7-W1.6-LS3.7-RD]
D3  1N4148W  [SOD-123_L2.7-W1.6-LS3.7-RD]
D4  1N4148W  [SOD-123_L2.7-W1.6-LS3.7-RD]
D5  1N4148W  [SOD-123_L2.7-W1.6-LS3.7-RD]
L3  10uH  [L0603]
Q15  2SK209-GR(TE85L,F)  [SOT-23-3_L2.9-W1.6-P1.90-LS2.8-BR]
R48  10K  [R0603]
R49  10K  [R0603]
R50  10K  [R0603]
R51  10K  [R0603]
R52  10K  [R0603]
R53  10K  [R0603]
R54  10K  [R0603]
R55  10K  [R0603]
R56  10K  [R0603]
R57  10K  [R0603]
R58  10K  [R0603]
R59  10K  [R0603]
R60  10K  [R0603]
R61  10K  [R0603]
R62  10K  [R0603]
R63  10K  [R0603]
U32  LM2904DT  [SOIC-8_L4.9-W3.9-P1.27-LS6.0-BL]  (sections 1,2)
U33  LM2904DT  [SOIC-8_L4.9-W3.9-P1.27-LS6.0-BL]  (section 2)
U34  LM2904DT  [SOIC-8_L4.9-W3.9-P1.27-LS6.0-BL]  (section 2)
U35  LM393DT  [SOIC-8_L5.0-W4.0-P1.27-LS6.0-BL]
U36  CJ431  [SOT-23-3_L2.9-W1.6-P1.90-LS2.8-BR]
sheet P8
MOT1  LCM1027A2445F  [VIBRATING-MOTOR-SMD_WELDING]
Q16  MJD122  [TO-252-3_L6.6-W6.1-P4.57-LS9.9-BR-CW]
RLY1  G6S-2 DC24  [RELAY-TH_G6S-2-4.5V]
U53  SN74AS1034ADR  [SOIC-14_L8.7-W3.9-P1.27-LS6.0-BL]
U54  TLP187(TPL,E(T  [SO-6_4P-L3.7-W4.6-P2.54-LS7.0-BL]
U55  ACPL-W314-500E  [SO-6_L6.8-W4.6-P1.27-LS11.5-BL]
U56  TLP5754(D4-TP,E(T  [SOP-6_L7.5-W3.8-P1.27-LS10.0-BL]
U57  SM74HC595D  [SOP-16_L10.0-W3.9-P1.27-LS6.0-BL]
sheet P9
U58  RFANT5220110A0T  [FILTER-SMD_L5.2-W2.0-L]
U59  KH-SAWD1921A  [FILTER-SMD_8P-L1.8-W1.4-BL_TDK_B39851BXXX]
U60VCO  MAX2606EUT+T  [SOT-23-6_L2.9-W1.6-P0.95-LS2.8-BL]

## Library data of the parts
C2-C5 C8-C16 C21-C23 = CAP_0603: Supplier Footprint: 0603
Q7-Q9 Q11-Q14 = 2N7002_C8545: Type: Drain Source Voltage (Vdss): Continuous Drain Current (Id): Power Dissipation (Pd): Drain Source On Resistance (RDS(on)@Vgs,Id):7.5Ω@10V,500mA Gate Threshold Voltage (Vgs(th)@Id):2.5V@250uA; LCSC Part Name: N沟道 耐压:60V 电流:115mA; Supplier Part: C8545; Manufacturer: CJ(江苏长电/长晶); Supplier Footprint: SOT-23; JLCPCB Part Class: Basic Part; Datasheet: https://atta.szlcsc.com/upload/public/pdf/source/20171228/C164913_15144413269051213916.pdf; Supplier: LCSC; Drain Source On Resistance (RDS(on)@Vgs,Id): 7.5Ω@10V,500mA; Gate Threshold Voltage (Vgs(th)@Id): 2.5V@250uA
U1 = L6388ED013TR: Driven Configuration:Half Bridge Load Type:MOSFET；IGBT Number of Drivers:2 Peak Output Current(sink):650mA Peak Output Current(source):400mA Supply Voltage:17V Supply Voltage:17V Rise Time:70ns Fall Time:40ns Operating Temperature:-40℃~+125℃@(Tj) Operatin; Supplier Part: C23921; Manufacturer: ST(意法半导体); Supplier Footprint: SOIC-8; JLCPCB Part Class: Extended Part; Datasheet: https://atta.szlcsc.com/upload/public/pdf/source/20140319/1457707022109.pdf; Supplier: LCSC; Driven Configuration: Half Bridge; Load Type: MOSFET；IGBT; Number of Drivers: 2; Peak Output Current(sink): 650mA; Peak Output Current(source): 400mA; Supply Voltage: 17V; Rise Time: 70ns; Fall Time: 40ns; Operating Temperature: -40℃~+125℃@(Tj)
BUZZER1 = QMB-09B-03: Oscillator Circuit:无源(外部驱动) Technology Type:电磁式 Operating Voltage:2V~5V Operating Voltage:2V~5V Frequency:2.7kHz Sound Pressure Level (SPL):85dB@3V,10cm Diameter (φD):9mm Height:5.7mm; LCSC Part Name: 无源蜂鸣器QMB-09B-03; Supplier Part: C96256; Manufacturer: 华能; Supplier Footprint: 插件,D=9mm; JLCPCB Part Class: Extended Part; Datasheet: https://atta.szlcsc.com/upload/public/pdf/source/20210401/C96256_958B17753B5AD7CBFBCFFC7C095B4484.pdf; Supplier: LCSC; Oscillator Circuit: 无源(外部驱动); Technology Type: 电磁式; Operating Voltage: 2V~5V; Sound Pressure Level (SPL): 85dB@3V,10cm; Diameter (φD): 9mm; Height: 5.7mm
J1 J1#2 = G5NB-1A-E-24VDC: Coil Voltage:- Contact Form:- Pin Number:- Contact Rating:- Maximum Switching Voltage:- Contact Material:- Maximum Switching Current:- Coil Type: Coil Resistance:- Contact Resistance:- Operate Time:- Release Time:- Operating Temperature:- Operating Temper; Supplier Part: C34758; Manufacturer: OMRON(欧姆龙); Supplier Footprint: 插件,7x20.4mm; JLCPCB Part Class: Extended Part; Datasheet: https://atta.szlcsc.com/upload/public/pdf/source/20231016/A4DFA824C568B609EAF69B430D690266.pdf; Supplier: LCSC
R1-R4 R9-R18 R20-R35 R37 R39-R67 = Res_0603: Supplier Footprint: 0603
SW1 = TS-1101-C-W: Circuit:SPST Actuator Style:Rectangle button Operating Force:260gf Mounting Style:Brick nogging Switch Length:6mm Switch Width:3.6mm Switch Height:2.5mm Strike Gundam:不带 Contact Current:50mA Voltage Rating (AC):- Voltage Rating (DC):12V Power Rating:- Ins; LCSC Part Name: 6*3.6*2.5mm 立贴 轻触开关; Supplier Part: C318938; Manufacturer: XKB Connectivity(中国星坤); Supplier Footprint: SMD; JLCPCB Part Class: Extended Part; Datasheet: https://atta.szlcsc.com/upload/public/pdf/source/20200227/C318938_C2E53B1EEDE37D980A33616AC086DE53.pdf; Supplier: LCSC; Circuit: SPST; Actuator Style: Rectangle button; Operating Force: 260gf; Mounting Style: Brick nogging; Switch Length: 6mm; Switch Width: 3.6mm; Switch Height: 2.5mm; Strike Gundam: 不带; Contact Current: 50mA; Voltage Rating (DC): 12V; Actuator/Cap Color: 白色带淡绿; With Lamp: No; Mechanical Life: 5万次; Operating Temperature: -30℃~+85℃
SW3-SW6 = ST-0-102-C03-N003-RS: Circuit:SPDT Mechanical Life:4万次 With Lamp:- Contact Current:3A Voltage Rating (AC):125V Voltage Rating (DC):- Actuator Type:Cylindrical button handle Pin Style:PCPin Mounting Style:- Operating Temperature:-25℃~+85℃ Operating Temperature:-25℃~+85℃; LCSC Part Name: 超小型钮子三脚二档(正弯脚); Supplier Part: C1788489; Manufacturer: YUEN FUNG(源丰); Supplier Footprint: 插件; JLCPCB Part Class: Extended Part; Datasheet: https://atta.szlcsc.com/upload/public/pdf/source/20201225/C1788489_FC77DF1FE334E292D58BD8615B26DB83.pdf; Supplier: LCSC; Circuit: SPDT; Mechanical Life: 4万次; Contact Current: 3A; Voltage Rating (AC): 125V; Actuator Type: Cylindrical button handle; Pin Style: PCPin; Operating Temperature: -25℃~+85℃
U2 U3 U6-U9 U25 = NE555N_C398063: LCSC Part Name: 时基集成芯片; Supplier Part: C398063; Manufacturer: HGSEMI(华冠); Supplier Footprint: DIP-8; JLCPCB Part Class: Extended Part; Datasheet: https://atta.szlcsc.com/upload/public/pdf/source/20210507/C398063_2BAEB56D23EF029756B1D4DE6D68B235.pdf; Supplier: LCSC
U26 = NE555P: Frequency:100kHz Supply Voltage:4.5V~16V Supply Voltage:4.5V~16V Supply Current:10mA Operating Temperature:0℃~+70℃ Operating Temperature:0℃~+70℃; Supplier Part: C46749; Manufacturer: TI(德州仪器); Supplier Footprint: DIP-8; JLCPCB Part Class: Extended Part; Datasheet: https://www.ti.com/cn/lit/gpn/ne555; Supplier: LCSC; Supply Voltage: 4.5V~16V; Supply Current: 10mA; Operating Temperature: 0℃~+70℃
L1-L3 = L_0603
Q10 = 2N7002,215: Type:1个NChannel Drain Source Voltage (Vdss): Continuous Drain Current (Id): Power Dissipation (Pd): Drain Source On Resistance (RDS(on)@Vgs,Id):5Ω@10V,500mA Gate Threshold Voltage (Vgs(th)@Id):2.5V@250uA Input Capacitance (Ciss@Vds):50pF@10V Operating Tem; LCSC Part Name: 1个N沟道 耐压:60V 电流:300mA; Supplier Part: C65189; Manufacturer: Nexperia(安世); Supplier Footprint: SOT-23; JLCPCB Part Class: Extended Part; Datasheet: https://atta.szlcsc.com/upload/public/pdf/source/20170103/1483439882638.pdf; Supplier: LCSC; Type: 1个NChannel; Drain Source On Resistance (RDS(on)@Vgs,Id): 5Ω@10V,500mA; Gate Threshold Voltage (Vgs(th)@Id): 2.5V@250uA; Input Capacitance (Ciss@Vds): 50pF@10V; Operating Temperature: -65℃~+150℃@(Tj)
R36 = RLM12FTCMR020: Resistance: Tolerance:±1% Tolerance:±1% Power(Watts): Temperature Coefficient:±50ppm/℃ Temperature Coefficient:±50ppm/℃; LCSC Part Name: 20mΩ ±1% 1W; Supplier Part: C393094; Manufacturer: 大毅科技; Supplier Footprint: 1206; JLCPCB Part Class: Extended Part; Datasheet: https://atta.szlcsc.com/upload/public/pdf/source/20190625/C393094_1D12BC44783F266A3BFDD0B943BC1FBD.pdf; Supplier: LCSC; Tolerance: ±1%; Temperature Coefficient: ±50ppm/℃
U10 = EL3H7(C)(TA)-G: Input voltage type:DC Output Type:光电三极管 Forward Voltage:1.2V Output Current:50mA Isolation Voltage(rms):3.75kV Reverse Voltage:6V Load Voltage:80V Number of Outputs:1 Collector-Emitter Saturation Voltage (Vce(sat)@Ic,IF):100mV@1mA,10mA Rise time:5us@2mA,1; LCSC Part Name: DC输入 隔离电压(rms):3750V; Supplier Part: C92243; Manufacturer: EVERLIGHT(亿光); Supplier Footprint: SSOP-4-1.27mm; JLCPCB Part Class: Extended Part; Datasheet: https://atta.szlcsc.com/upload/public/pdf/source/20180207/C181879_15179899084781356541.pdf; Supplier: LCSC; Input voltage type: DC; Output Type: 光电三极管; Forward Voltage: 1.2V; Output Current: 50mA; Isolation Voltage(rms): 3.75kV; Reverse Voltage: 6V; Load Voltage: 80V; Number of Outputs: 1; Collector-Emitter Saturation Voltage (Vce(sat)@Ic,IF): 100mV@1mA,10mA; Rise time: 5us@2mA,100Ω; Fall time: 3us@2mA,100Ω; Operating Temperature: -55℃~+110℃
U11 = SN74HCT14DR: Input Type:Schmitt Trigger Supply Voltage(Single):4.5V~5.5V Supply Voltage(Single):4.5V~5.5V Supply Current (Max):2uA Number of Circuits:6 Number of Inputs:1 Sink Current:4mA Source Current:4mA High level range (VIH):1.9V~2.1V High level range (VIH):1.9V~; LCSC Part Name: 六路施密特触发反相器; Supplier Part: C6769; Manufacturer: TI(德州仪器); Supplier Footprint: SOIC-14; JLCPCB Part Class: Extended Part; Datasheet: https://www.ti.com/cn/lit/gpn/sn74hct14; Supplier: LCSC; Input Type: Schmitt Trigger; Supply Voltage(Single): 4.5V~5.5V; Supply Current (Max): 2uA; Number of Circuits: 6; Number of Inputs: 1; Sink Current: 4mA; Source Current: 4mA; High level range (VIH): 1.9V~2.1V; Low level range (VIL): 500mV~600mV; Max Propagation Delay: 30ns@5.5V,50pF; Series: 74HCTSeries; Operating Temperature: -40℃~+85℃
U12 = ADS1015IDGSR: Supplier Part: C193969; Manufacturer: TI(德州仪器); Supplier Footprint: VSSOP-10-0.5mm; JLCPCB Part Class: Extended Part; Datasheet: https://www.ti.com/cn/lit/gpn/ads1015; Supplier: LCSC
U17 U18 U20-U22 U24 = UA741CD: Number of Circuits:单路 Gain Bandwidth Product(GBP):1MHz Current - Input Bias(Ib):10nA Slew Rate(SR):0.5V/us Output Current:25mA -3db Bandwidth:- Operating Temperature:0℃~+70℃ Operating Temperature:0℃~+70℃; Supplier Part: C1346799; Manufacturer: ST(意法半导体); Supplier Footprint: SO-8; JLCPCB Part Class: Extended Part; Datasheet: https://atta.szlcsc.com/upload/public/pdf/source/20211229/F5D7931C1428D962D9179141BCF887F3.pdf; Supplier: LCSC; Number of Circuits: 单路; Gain Bandwidth Product(GBP): 1MHz; Current - Input Bias(Ib): 10nA; Slew Rate(SR): 0.5V/us; Output Current: 25mA; Operating Temperature: 0℃~+70℃
U23 = DS18B20: Temperature range:-55℃~+125℃ Temperature range:-55℃~+125℃ Resolution:±0.4℃ Resolution:±0.4℃ Supply Voltage:3V~5.5V Supply Voltage:3V~5.5V Standby Current:- Interface Type:-; Supplier Part: C376006; Manufacturer: UMW(友台半导体); Supplier Footprint: TO-92; JLCPCB Part Class: Extended Part; Datasheet: https://atta.szlcsc.com/upload/public/pdf/source/20231109/DC3DA9D47D486EF40A6E0F08B9A498E3.pdf; Supplier: LCSC; Temperature range: -55℃~+125℃; Resolution: ±0.4℃; Supply Voltage: 3V~5.5V
U36 U37 = CJ431_C3113: Output Type:Adjustable Output Voltage:2.5V~36V Output Voltage:2.5V~36V Output Current:100mA Tolerance:±0.5% Tolerance:±0.5% Temperature Coefficient:50ppm/℃ Minimum Cathode Current for Regulation:1mA Operating Temperature:-25℃~+85℃@(TA) Operating Temperatu; Supplier Part: C3113; Manufacturer: CJ(江苏长电/长晶); Supplier Footprint: SOT-23; JLCPCB Part Class: Basic Part; Datasheet: https://atta.szlcsc.com/upload/public/pdf/source/20180130/C154948_15172973254591323355.pdf; Supplier: LCSC; Output Type: Adjustable; Output Voltage: 2.5V~36V; Output Current: 100mA; Tolerance: ±0.5%; Temperature Coefficient: 50ppm/℃; Minimum Cathode Current for Regulation: 1mA; Operating Temperature: -25℃~+85℃@(TA)
U38 = SN74HC148DR: Type:Priority Encoders Voltage Supply Source:Single supply Supply Voltage:2V~6V Supply Voltage:2V~6V Sink Current:5.2mA Source Current:5.2mA Operating temperature:-40℃~+85℃ Operating temperature:-40℃~+85℃; Supplier Part: C6819; Manufacturer: TI(德州仪器); Supplier Footprint: SOIC-16; JLCPCB Part Class: Extended Part; Datasheet: https://www.ti.com/cn/lit/gpn/sn74hc148; Supplier: LCSC; Type: Priority Encoders; Voltage Supply Source: Single supply; Supply Voltage: 2V~6V; Sink Current: 5.2mA; Source Current: 5.2mA; Operating temperature: -40℃~+85℃
U35 U40-U43 U49 = LM393DT: Input Offset Voltage (Vos):5mV Input Bias Current (Ib):250nA Input Hysteresis Voltage (Vhys):- Common Mode Rejection Ratio (CMRR):- Supply Voltage:1V~18V；2V~36V Supply Voltage:1V~18V；2V~36V Output Type:开集 Output Mode:- Supply Current:2.5mA Operating Tempe; Supplier Part: C32901; Manufacturer: ST(意法半导体); Supplier Footprint: SOIC-8; JLCPCB Part Class: Extended Part; Datasheet: https://atta.szlcsc.com/upload/public/pdf/source/20140704/1457707098538.pdf; Supplier: LCSC; Input Offset Voltage (Vos): 5mV; Input Bias Current (Ib): 250nA; Supply Voltage: 1V~18V；2V~36V; Output Type: 开集; Supply Current: 2.5mA; Operating Temperature: 0℃~+70℃
U45 = MS9708: Interface:Parallel Number of Channels:- Output Type:- Supply Voltage:2.7V~5.5V Supply Voltage:2.7V~5.5V Resolution:8Bit Integral nonlinearity:- Integral nonlinearity:- Settling Time:- Operating Temperature:- Operating Temperature:-; Supplier Part: C1509022; Manufacturer: 杭州瑞盟; Supplier Footprint: TSSOP-28; JLCPCB Part Class: Extended Part; Datasheet: https://atta.szlcsc.com/upload/public/pdf/source/20201221/C1509022_D65AE83FBAD82A86429FD4D058009045.pdf; Supplier: LCSC; Interface: Parallel; Supply Voltage: 2.7V~5.5V; Resolution: 8Bit
U47 = 74HC393D,653: Logic Type:Binary Counter Direction:向上计数器 Supply Voltage:2V~6V Supply Voltage:2V~6V Number of Elements:2 Number of Bits per Element:4 Trigger Type:负边沿 Reset Style:异步 Timing mode:- Count Rate:107MHz Operating Temperature:-40℃~+125℃ Operating Temperature:-4; LCSC Part Name: 107MHz 4位二进制纹波计数器; Supplier Part: C5641; Manufacturer: Nexperia(安世); Supplier Footprint: SOIC-14; JLCPCB Part Class: Extended Part; Datasheet: https://atta.szlcsc.com/upload/public/pdf/source/20170601/1496285793336.pdf; Supplier: LCSC; Logic Type: Binary Counter; Direction: 向上计数器; Supply Voltage: 2V~6V; Number of Elements: 2; Number of Bits per Element: 4; Trigger Type: 负边沿; Reset Style: 异步; Count Rate: 107MHz; Operating Temperature: -40℃~+125℃
U48 = 74HC573PW,118: Logic Type:D-Typelocking器 Output Type:Tri-State Supply Voltage:2V~6V Supply Voltage:2V~6V Number of Channels:8 Source Current:7.8mA Sink Current:7.8mA Propagation Delay:14ns Series: OperatingTemperature:-40℃~+125℃ OperatingTemperature:-40℃~+125℃; LCSC Part Name: 三态输出八路D型锁存器; Supplier Part: C5944; Manufacturer: Nexperia(安世); Supplier Footprint: TSSOP-20; JLCPCB Part Class: Extended Part; Datasheet: https://atta.szlcsc.com/upload/public/pdf/source/20170508/1494211011601.pdf; Supplier: LCSC; Logic Type: D-Typelocking器; Output Type: Tri-State; Supply Voltage: 2V~6V; Number of Channels: 8; Source Current: 7.8mA; Sink Current: 7.8mA; Propagation Delay: 14ns; OperatingTemperature: -40℃~+125℃
U50 = 74LVC1G08GW,125: Logic Gate Type:与门 Number of Channels:1 Supply Voltage:1.65V~5.5V Supply Voltage:1.65V~5.5V Quiescent Current (Max):4uA Sink Current:32mA Source Current:32mA High Level Range (VIH):1.7V~2V High Level Range (VIH):1.7V~2V Low Level Range (VIL):700mV~800mV L; Supplier Part: C12512; Manufacturer: Nexperia(安世); Supplier Footprint: SOT-353; JLCPCB Part Class: Extended Part; Datasheet: https://atta.szlcsc.com/upload/public/pdf/source/20171208/C12512_15127341094081171460.pdf; Supplier: LCSC; Logic Gate Type: 与门; Number of Channels: 1; Supply Voltage: 1.65V~5.5V; Quiescent Current (Max): 4uA; Sink Current: 32mA; Source Current: 32mA; High Level Range (VIH): 1.7V~2V; Low Level Range (VIL): 700mV~800mV; Series: 74LVCSeries; Propagation Delay Time: 4ns@5V,50pF; Operating Temperature: -40℃~+125℃
D1-D5 = 1N4148W_C212811: Diode Configuration: Forward Voltage (Vf@If):1.25V@150mA Reverse Voltage (Vr): Average Rectified Current (Io): Reverse Leakage Current:1uA@75V Reverse Recovery Time (trr): Operating Temperature:-55℃~+150℃ Operating Temperature:-55℃~+150℃; LCSC Part Name: 电压:75V 电流:150mA; Supplier Part: C212811; Manufacturer: DIOTEC(德欧泰克); Supplier Footprint: SOD-123F; JLCPCB Part Class: Extended Part; Datasheet: https://atta.szlcsc.com/upload/public/pdf/source/20240401/B57DB40AB21CD49346F0A8BA009652C6.pdf; Supplier: LCSC; Forward Voltage (Vf@If): 1.25V@150mA; Reverse Leakage Current: 1uA@75V; Operating Temperature: -55℃~+150℃
Q15 = 2SK209-GR(TE85L,F): FET Type:N-Channel Gate-Source Cutoff Voltage (VGS(off)@ID):1.5V@100nA Gate-Source Breakdown Voltage (V(BR)GSS):50V Total Device Dissipation (Pd):150mW Static Drain-Source On Resistance (RDS(on)):- Drain Current (Idss@Vds,Vgs=0):14mA@10V Input Capacitance; Supplier Part: C61792; Manufacturer: TOSHIBA(东芝); Supplier Footprint: SC-59; JLCPCB Part Class: Extended Part; Datasheet: https://atta.szlcsc.com/upload/public/pdf/source/20151029/1457707543691.pdf; Supplier: LCSC; FET Type: N-Channel; Gate-Source Cutoff Voltage (VGS(off)@ID): 1.5V@100nA; Gate-Source Breakdown Voltage (V(BR)GSS): 50V; Total Device Dissipation (Pd): 150mW; Drain Current (Idss@Vds,Vgs=0): 14mA@10V; Input Capacitance (Ciss@Vds): 13pF@10V
U32-U34 = LM2904DT: Number of Circuits:双路 Gain Bandwidth Product(GBP):700kHz Current - Input Bias(Ib):20nA Slew Rate(SR):0.6V/us Output Current:30mA -3db Bandwidth:- Output Type:- Rail to Rail:- Supply Current:700uA Operating Temperature:-40℃~+125℃ Operating Temperature:-40℃; Supplier Part: C105411; Manufacturer: ST(意法半导体); Supplier Footprint: SOIC-8; JLCPCB Part Class: Extended Part; Datasheet: https://atta.szlcsc.com/upload/public/pdf/source/20181105/C310416_9E6D79A6CEDF880925D483095CEFA2E7.pdf; Supplier: LCSC; Number of Circuits: 双路; Gain Bandwidth Product(GBP): 700kHz; Current - Input Bias(Ib): 20nA; Slew Rate(SR): 0.6V/us; Output Current: 30mA; Supply Current: 700uA; Operating Temperature: -40℃~+125℃
MOT1 = LCM1027A2445F: Type:扁平振动马达 Rated Voltage:3V Rated Voltage:3V Rated Current:80mA Rated Speed:10000rpm Operating Temperature:-20℃~+60℃ Operating Temperature:-20℃~+60℃ Sense Of Rotation:CW；CCW; LCSC Part Name: 扁平1027 振动马达; Supplier Part: C2759984; Manufacturer: LEADER(立得); JLCPCB Part Class: Extended Part; Datasheet: https://atta.szlcsc.com/upload/public/pdf/source/20210326/C2759984_5008EC97BD438BDFB6866D31635439F4.pdf; Supplier: LCSC; Type: 扁平振动马达; Rated Voltage: 3V; Rated Current: 80mA; Rated Speed: 10000rpm; Operating Temperature: -20℃~+60℃; Sense Of Rotation: CW；CCW
Q16 = MJD122_C59488: Supplier Part: C59488; Manufacturer: CJ(江苏长电/长晶); Supplier Footprint: TO-252-2(DPAK); JLCPCB Part Class: Extended Part; Datasheet: https://atta.szlcsc.com/upload/public/pdf/source/20230302/E6FC91296A9A3DD0AA86197AAF35A876.pdf; Supplier: LCSC
RLY1 = G6S-2 DC24: Coil Voltage:24V Contact Form:两组转换:2C(DPDT-转换) Pin Number:- Contact Rating:- Maximum Switching Voltage:250V@AC；220V@DC Contact Material:silver+Gold plating Coil Resistance:- Maximum Switching Current:2A Operate Time:4ms Release Time:4ms Coil Type:- Contac; LCSC Part Name: G6S-2-24V; Supplier Part: C15990; Manufacturer: OMRON(欧姆龙); Supplier Footprint: DIP,7.3x14.8mm; JLCPCB Part Class: Extended Part; Supplier: LCSC; Coil Voltage: 24V; Contact Form: 两组转换:2C(DPDT-转换); Maximum Switching Voltage: 250V@AC；220V@DC; Contact Material: silver+Gold plating; Maximum Switching Current: 2A; Operate Time: 4ms; Release Time: 4ms; Operating Temperature: -40℃~+85℃
U53 = SN74AS1034ADR: Input type:- output type:High Speed Supply Voltage:4.5V~5.5V Supply Voltage:4.5V~5.5V Number of Elements:6 Number of Bits per Element:1 Sink Current:48mA Source Current:48mA Logic Family:74AS Operating Temperature:0℃~+70℃ Operating Temperature:0℃~+70℃; Supplier Part: C140235; Manufacturer: TI(德州仪器); Supplier Footprint: SOIC-14; JLCPCB Part Class: Extended Part; Datasheet: https://www.ti.com/cn/lit/gpn/sn74as1034a; Supplier: LCSC; output type: High Speed; Supply Voltage: 4.5V~5.5V; Number of Elements: 6; Number of Bits per Element: 1; Sink Current: 48mA; Source Current: 48mA; Logic Family: 74AS; Operating Temperature: 0℃~+70℃
U54 = TLP187(TPL,E(T: Input voltage type:DC Output Type:达林顿晶体管 Forward Voltage:1.25V Output Current:150mA Isolation Voltage(rms):3.75kV Reverse Voltage:5V Receiving End Voltage:300V Number of Outputs:1 Collector-Emitter Saturation Voltage (Vce(sat)@Ic,IF):1.2V@100mA,10mA Rise; LCSC Part Name: DC输入 隔离电压(rms):3750V; Supplier Part: C393886; Manufacturer: TOSHIBA(东芝); Supplier Footprint: SO-4-4.6mm; JLCPCB Part Class: Extended Part; Datasheet: https://atta.szlcsc.com/upload/public/pdf/source/20190805/C393886_AF415B075356275C53BC3F5ABA17A604.pdf; Supplier: LCSC; Input voltage type: DC; Output Type: 达林顿晶体管; Forward Voltage: 1.25V; Output Current: 150mA; Isolation Voltage(rms): 3.75kV; Reverse Voltage: 5V; Receiving End Voltage: 300V; Number of Outputs: 1; Collector-Emitter Saturation Voltage (Vce(sat)@Ic,IF): 1.2V@100mA,10mA; Rise time: 40us@10mA,100Ω; Fall time: 15us@10mA,100Ω; Operating Temperature: -55℃~+110℃
U55 = ACPL-W314-500E: Supplier Part: C194137; Manufacturer: Broadcom/AVAGO(安华高); Supplier Footprint: SO-6; JLCPCB Part Class: Extended Part; Datasheet: https://atta.szlcsc.com/upload/public/pdf/source/20230925/D54AA4D9C29B9F4DB3ACC874E532BEF4.pdf; Supplier: LCSC
U56 = TLP5754(D4-TP,E(T: Supplier Part: C843785; Manufacturer: TOSHIBA(东芝); Supplier Footprint: SO-6L-300mil; JLCPCB Part Class: Extended Part; Datasheet: https://atta.szlcsc.com/upload/public/pdf/source/20200927/C843785_6F003691A0C39BB52BA0AA95AD360EBF.pdf; Supplier: LCSC
U57 = SM74HC595D: Supplier Part: C93838; Manufacturer: 明微; Supplier Footprint: SOP-16; JLCPCB Part Class: Extended Part; Datasheet: https://atta.szlcsc.com/upload/public/pdf/source/20170120/1484891305667.pdf; Supplier: LCSC
U58 = RFANT5220110A0T: Central Frequency:2.45GHz Peak Gain:2dBi Peak Gain:2dBi Power capacity:5W VSWR:2; Supplier Part: C127611; Manufacturer: Walsin(华新科); Supplier Footprint: SMD,2x5.2mm; JLCPCB Part Class: Extended Part; Datasheet: https://atta.szlcsc.com/upload/public/pdf/source/20180326/C127611_CAA3DCCF3A021118096CAD99FC50242A.pdf; Supplier: LCSC; Central Frequency: 2.45GHz; Peak Gain: 2dBi; Power capacity: 5W; VSWR: 2
U59 = KH-SAWD1921A: Supplier Part: C7501979; Manufacturer: kinghelm(金航标); Supplier Footprint: SMD-8P,1.8x1.4mm; Datasheet: https://atta.szlcsc.com/upload/public/pdf/source/20240408/6A2803C6A1E7CEA61269CC8E1076ECBB.pdf; Supplier: LCSC
U60VCO = MAX2606EUT+T: frequency range:70MHz~150MHz frequency range:70MHz~150MHz supply voltage:2.7V~5.5V supply voltage:2.7V~5.5V phase noise:-112dBc/Hz Harmonics:-30dBc operating temperature:-40℃~+85℃ operating temperature:-40℃~+85℃; Supplier Part: C110623; Manufacturer: ADI(亚德诺)/MAXIM(美信); Supplier Footprint: SOT-23-6; JLCPCB Part Class: Extended Part; Datasheet: https://atta.szlcsc.com/upload/public/pdf/source/20200305/C490969_FF4CF2B3DB55CBD700A1B1DBC0B3685D.pdf; Supplier: LCSC; frequency range: 70MHz~150MHz; supply voltage: 2.7V~5.5V; phase noise: -112dBc/Hz; Harmonics: -30dBc; operating temperature: -40℃~+85℃

## Nets
+VDD: U17.7(VCC+) U18.7(VCC+) U20.7(VCC+) U21.7(VCC+) U22.7(VCC+) U24.7(VCC+)
-VDD: U17.4(VCC-) U18.4(VCC-) U20.4(VCC-) U21.4(VCC-) U22.4(VCC-) U24.4(VCC-)
AGND: C21.2 C23.2 J1#2.1 Q8.2(S) Q10.2(S) Q15.2(D) Q16.3(E) R17.1 R50.1 R51.1 R53.1 R58.2 R59.2 R60.1 R67.1 U36.3(A) U37.3(A) U38.8(GND) U54.4(EM)
GND: C2.2 C4.1 C5.1 C8.1 C9.1 C10.1 C11.1 J1#2.3 Q12.2(S) Q13.2(S) R37.2 SW1.2 U2.1(GND) U3.1(GND) U6.1(GND) U7.1(GND) U8.1(GND) U9.1(GND) U17.3(+ input) U18.3(+ input) U20.3(+ input) U21.3(+ input) U22.3(+ input) U23.1(GND) U25.1(GND) U54.3(CAT)
VCC: BUZZER1.1 C2.1 J1.4 J1#2.4 L3.1 MOT1.2(+) R1.1 R3.1 R9.1 R11.1 R13.1 R15.1 R36.2 R61.2 R64.2 RLY1.1 SW3.2 SW4.2 SW5.2 SW6.2 U1.3(VCC) U1.4(GND) U2.4(RESET) U2.8(VCC) U3.4(RESET) U3.8(VCC) U6.4(RESET) U6.8(VCC) U7.4(RESET) U7.8(VCC) U8.4(RESET) U8.8(VCC) U9.4(RESET) U9.8(VCC) U10.4 U23.3(VDD) U24.2(- input) U25.8(VCC) U26.8(VCC) U38.16(VCC) U40.3(+IN) U40.4(V-) U40.5(+IN) U40.8(V+) U41.3(+IN) U41.4(V-) U41.5(+IN) U41.8(V+) U42.3(+IN) U42.4(V-) U42.5(+IN) U42.8(V+) U43.3(+IN) U43.4(V-) U43.5(+IN) U43.8(V+) U48.15(Q4) U49.4(V-) U49.8(V+)
VDD1: Q9.3(D)
VDD2: Q10.3(D)
VDD3: Q11.3(D) Q14.3(D)
NET1: C3.2 Q7.2(S) Q8.3(D) R52.1 R54.1 U1.6(OUT) U38.7(A1) U53.1(1A) U53.11(5A)
NET2: R18.1 U38.6(A2)
NET3: U38.9(A0)
NET4: Q9.1(G) U2.2(TRIG) U3.2(TRIG) U6.2(TRIG) U7.2(TRIG) U48.20(VCC)
NET5: C22.2 R57.2 U8.2(TRIG) U33.7(OUT) U48.19(Q0)
NET6: U9.2(TRIG) U48.18(Q1)
NET7: U11.1(1A) U48.17(Q2)
NET8: Q11.1(G) Q12.1(G) Q13.1(G) Q14.1(G) U11.2(1Y) U48.16(Q3)
NET10: U48.14(Q5)
NET11: Q7.3(D) U1.1(LIN) U48.13(Q6)
NET12: Q11.2(S) Q12.3(D) U1.2(HIN) U48.12(Q7)
NET13: Q9.2(S) Q13.3(D) Q14.2(S) U48.11(LE)
NET14: C12.2 C14.2 L1.1 R20.2 R21.2 R25.2 R26.1 U2.3(OUT) U3.3(OUT) U6.3(OUT) U7.3(OUT)
NET15: C16.1 R28.2 R35.2 U8.3(OUT) U18.6(Output) U22.6(Output) U49.2(-IN)
NET16: U9.3(OUT) U49.5(+IN)
NET17: U49.6(-IN)
NET18: U50.1(B)
Net-(BUZZER1-2): BUZZER1.2 U25.3(OUT)
Net-(C3-1): C3.1 U1.8(VBOOT)
Net-(C4-2): C4.2 U2.5(CONT)
Net-(C5-2): C5.2 U3.5(CONT)
Net-(C8-2): C8.2 U6.5(CONT)
Net-(C9-2): C9.2 U7.5(CONT)
Net-(C10-2): C10.2 U8.5(CONT)
Net-(C11-2): C11.2 U9.5(CONT)
Net-(C12-1): C12.1 C13.1 U12.5(AIN1)
Net-(C13-2): C13.2 C14.1
Net-(C15-1): C15.1 R27.2 R29.1 U17.6(Output)
Net-(C15-2): C15.2 R26.2 R27.1 U17.2(- input)
Net-(C16-2): C16.2 R28.1 R29.2 U18.2(- input)
Net-(C21-1): C21.1 R56.2 U33.5(IN+)
Net-(C22-1): C22.1 R55.2 R56.1
Net-(C23-1): C23.1 D5.1(K) R60.2 R62.1 R63.2 U34.5(IN+) U36.1(R)
Net-(D1-1): D1.1(K) D3.1(K) R48.2 R49.2 R55.1 R59.1
Net-(D1-2): D1.2(A) D2.1(K) U32.1(OUT)
Net-(D2-2): D2.2(A) R48.1 R54.2 U32.2(IN-)
Net-(D3-2): D3.2(A) D4.1(K) U32.7(OUT)
Net-(D4-2): D4.2(A) R49.1 R51.2 U32.6(IN-)
Net-(D5-2): D5.2(A) L3.2 Q15.1(S)
Net-(J1#2-2): J1#2.2 U10.2
Net-(J1-1): J1.1 U26.3(OUT)
Net-(L1-2): L1.2 L2.1
Net-(L2-2): L2.2 R23.2
Net-(MOT1-1): MOT1.1(-) Q16.2(C)
Net-(Q7-1): Q7.1(G) U1.7(HVG)
Net-(Q8-1): Q8.1(G) U1.5(LVG)
Net-(Q10-1): Q10.1(G) R17.2 U10.3
Net-(Q15-3): Q15.3(G) U35.7(OUT)
Net-(Q16-1): Q16.1(B) U53.10(5Y)
Net-(R1-2): R1.2 R2.1 U2.7(DISCH)
Net-(R2-2): R2.2 U2.6(THRES)
Net-(R3-2): R3.2 R4.1 U3.7(DISCH)
Net-(R4-2): R4.2 U3.6(THRES)
Net-(R9-2): R9.2 R10.1 U6.7(DISCH)
Net-(R10-2): R10.2 U6.6(THRES)
Net-(R11-2): R11.2 R12.1 U7.7(DISCH)
Net-(R12-2): R12.2 U7.6(THRES)
Net-(R13-2): R13.2 R14.1 U8.7(DISCH)
Net-(R14-2): R14.2 U8.6(THRES)
Net-(R15-2): R15.2 R16.1 U9.7(DISCH)
Net-(R16-2): R16.2 U9.6(THRES)
Net-(R18-2): R18.2 U10.1
Net-(R20-1): R20.1 R22.1 U12.4(AIN0)
Net-(R21-1): R21.1 R22.2
Net-(R23-1): R23.1 R24.1 U12.6(AIN2)
Net-(R24-2): R24.2 R25.1
Net-(R30-1): R30.1 U23.2(DQ)
Net-(R30-2): R30.2 R31.1 U20.2(- input)
Net-(R31-2): R31.2 R33.1 U20.6(Output)
Net-(R32-1): R32.1 R33.2 U21.2(- input)
Net-(R32-2): R32.2 R34.1 U21.6(Output)
Net-(R34-2): R34.2 R35.1 U22.2(- input)
Net-(R36-1): R36.1 R37.1 U24.3(+ input)
Net-(R39-1): R39.1 R40.1 R41.1 R42.1 U25.6(THRES) U25.7(DISCH)
Net-(R39-2): R39.2 SW3.3
Net-(R40-2): R40.2 SW4.3
Net-(R41-2): R41.2 SW5.3
Net-(R42-2): R42.2 SW6.3
Net-(R43-1): R43.1 R44.2 U40.6(-IN)
Net-(R43-2): R43.2 U37.1(R) U40.2(-IN)
Net-(R44-1): R44.1 R45.2 U41.2(-IN)
Net-(R45-1): R45.1 R46.2 U41.6(-IN)
Net-(R46-1): R46.1 R65.2 U42.2(-IN)
Net-(R47-1): R47.1 R66.2 U43.2(-IN)
Net-(R47-2): R47.2 R65.1 U42.6(-IN)
Net-(R50-2): R50.2 R52.2 U32.5(IN+)
Net-(R53-2): R53.2 U32.3(IN+)
Net-(R57-1): R57.1 R58.1 U33.6(IN-)
Net-(R61-1): R61.1 U36.2(K)
Net-(R62-2): R62.2 U35.6(-IN)
Net-(R63-1): R63.1 U34.6(IN-)
Net-(R64-1): R64.1 U37.2(K)
Net-(R66-1): R66.1 R67.2 U43.6(-IN)
Net-(RLY1-12): RLY1.12 U54.6(COL)
Net-(SW1-1): SW1.1 U25.4(RESET)
Net-(U12-7): U12.7(AIN3) U24.6(Output)
Net-(U34-7): U34.7(OUT) U35.5(+IN)
Net-(U38-1): U38.1(4) U42.1(OUT)
Net-(U38-2): U38.2(5) U42.7(OUT)
Net-(U38-3): U38.3(6) U43.1(OUT)
Net-(U38-4): U38.4(7) U43.7(OUT)
Net-(U38-10): U38.10(0) U40.1(OUT)
Net-(U38-11): U38.11(1) U40.7(OUT)
Net-(U38-12): U38.12(2) U41.1(OUT)
Net-(U38-13): U38.13(3) U41.7(OUT)
Net-(U45-1): U45.1(DB7) U47.8(2Q3) U48.9(D7)
Net-(U45-2): U45.2(DB6) U47.9(2Q2) U48.8(D6)
Net-(U45-3): U45.3(DB5) U47.10(2Q1) U48.7(D5)
Net-(U45-4): U45.4(DB4) U47.11(2Q0) U48.6(D4)
Net-(U45-5): U45.5(DB3) U47.6(1Q3) U48.5(D3)
Net-(U45-6): U45.6(DB2) U47.5(1Q2) U48.4(D2)
Net-(U45-7): U45.7(DB1) U47.4(1Q1) U48.3(D1)
Net-(U45-8): U45.8(DB0) U47.3(1Q0) U48.2(D0)
Net-(U45-22): U45.22(IOUTA) U49.3(+IN)
Net-(U47-2): U47.2(1MR) U49.7(OUT)
Net-(U47-12): U47.12(2MR) U50.4(Y)
Net-(U49-1): U49.1(OUT) U50.2(A)
Net-(U53-2): U53.2(1Y) U54.1(AN)

Not connected (* = marked no-connect by the designer): J1 2 3; RLY1 3 4 5 8 9 10; SW3 1 4 5; SW4 1 4 5; SW5 1 4 5; SW6 1 4 5; U11 3(2A) 4(2Y) 5(3A) 6(3Y) 7(GND) 8(4Y) 9(4A) 10(5Y) 11(5A) 12(6Y) 13(6A) 14(VCC); U12 1(ADDR) 2(ALERT/RDY) 3(GND) 8(VDD) 9(SDA) 10(SCL); U17 1(null1)* 5(null2)* 8(N.C.)*; U18 1(null1)* 5(null2)* 8(N.C.)*; U20 1(null1)* 5(null2)* 8(N.C.)*; U21 1(null1)* 5(null2)* 8(N.C.)*; U22 1(null1)* 5(null2)* 8(N.C.)*; U24 1(null1)* 5(null2)* 8(N.C.)*; U25 2(TRIG) 5(CONT); U26 1(GND) 2(TRIG) 4(RESET) 5(CONT) 6(THRES) 7(DISCH); U32 4(V-) 8(V+); U35 1(OUT) 2(-IN) 3(+IN) 4(V-) 8(V+); U38 5(EI) 14(GS) 15(EO); U45 9(NC)* 10(NC)* 11(NC)* 12(NC)* 13(NC)* 14(NC)* 15(SLEEP) 16(REFLO) 17(REFIO) 18(FSADJ) 19(COMP1) 20(ACOM) 21(IOUTB) 23(COMP2) 24(AVDD) 25(NC) 26(DCOM) 27(DVDD) 28(CLOCK); U47 1(1CP#) 7(GND) 13(2CP#) 14(VCC); U48 1(OE#) 10(GND); U50 3(GND) 5(VCC); U53 3(2A) 4(2Y) 5(3A) 6(3Y) 7(GND) 8(4Y) 9(4A) 12(6Y) 13(6A) 14(VCC); U55 1(ANODE) 2(NC) 3(CATHODE) 4(VEE) 5(VO) 6(VCC); U56 1(ANODE) 2(NC) 3(CAT) 4(GND) 5(VO) 6(VCC); U57 1(Q1) 2(Q2) 3(Q3) 4(Q4) 5(Q5) 6(Q6) 7(Q7) 8(GND) 9(Q7&apos;) 10(SCLR#) 11(SCK) 12(RCK) 13(G#) 14(SER) 15(Q0) 16(VCC); U58 1 2; U59 1(RX_OUT) 2(GND) 3(TX_IN) 4(GND) 5(GND) 6(ANT) 7(GND) 8(GND); U60VCO 1(IND) 2(GND) 3(TUNE) 4(OUT-) 5(VCC) 6(OUT+)

## Notes on the sheets
sheet 4
- TODO : relay ctrl using driving ic, clk divider, frequency divider
sheet 5
- RMS
- switching regulation
sheet 6
- IGBT Gate Driver Opto
- MOS Gate Driver Opto
- frequency divider using shift register
  frequency divider using dq ff
sheet 7
- pll transmitter circuit
- pll receiver circuit
- 2n2222 rf amplifier circuit

# Board PCB1
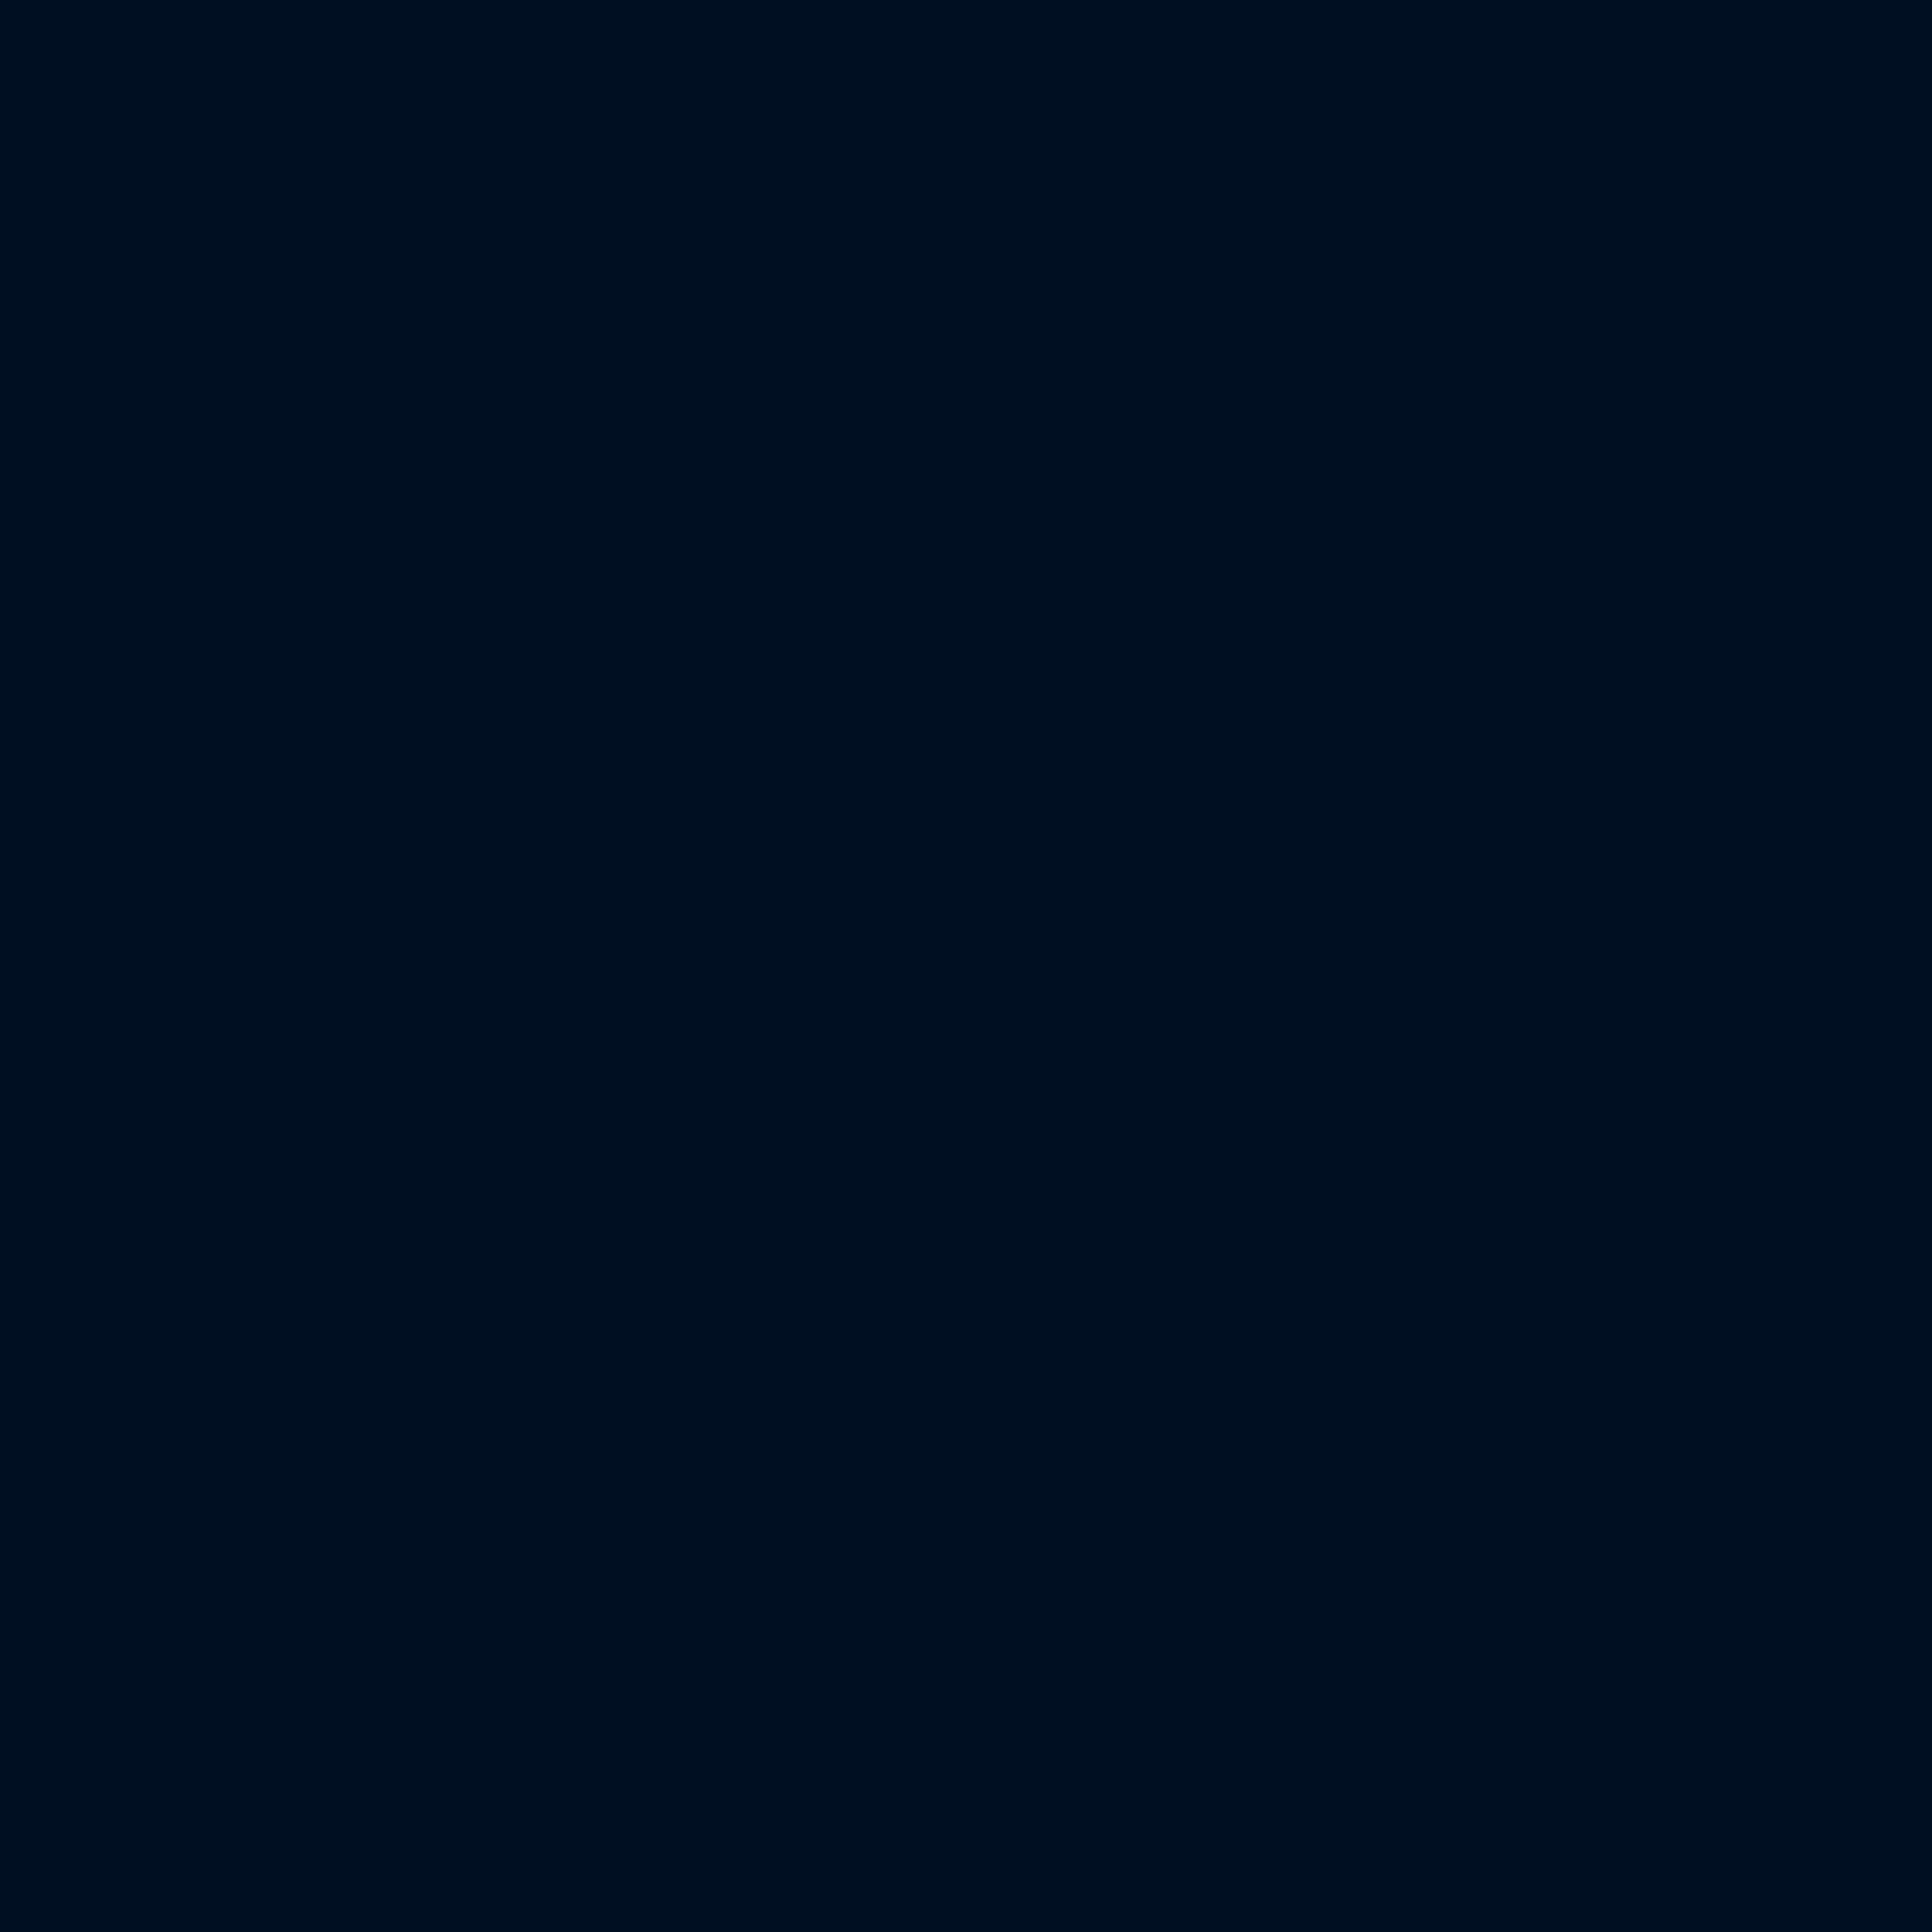
[diagram p7: board, top side]
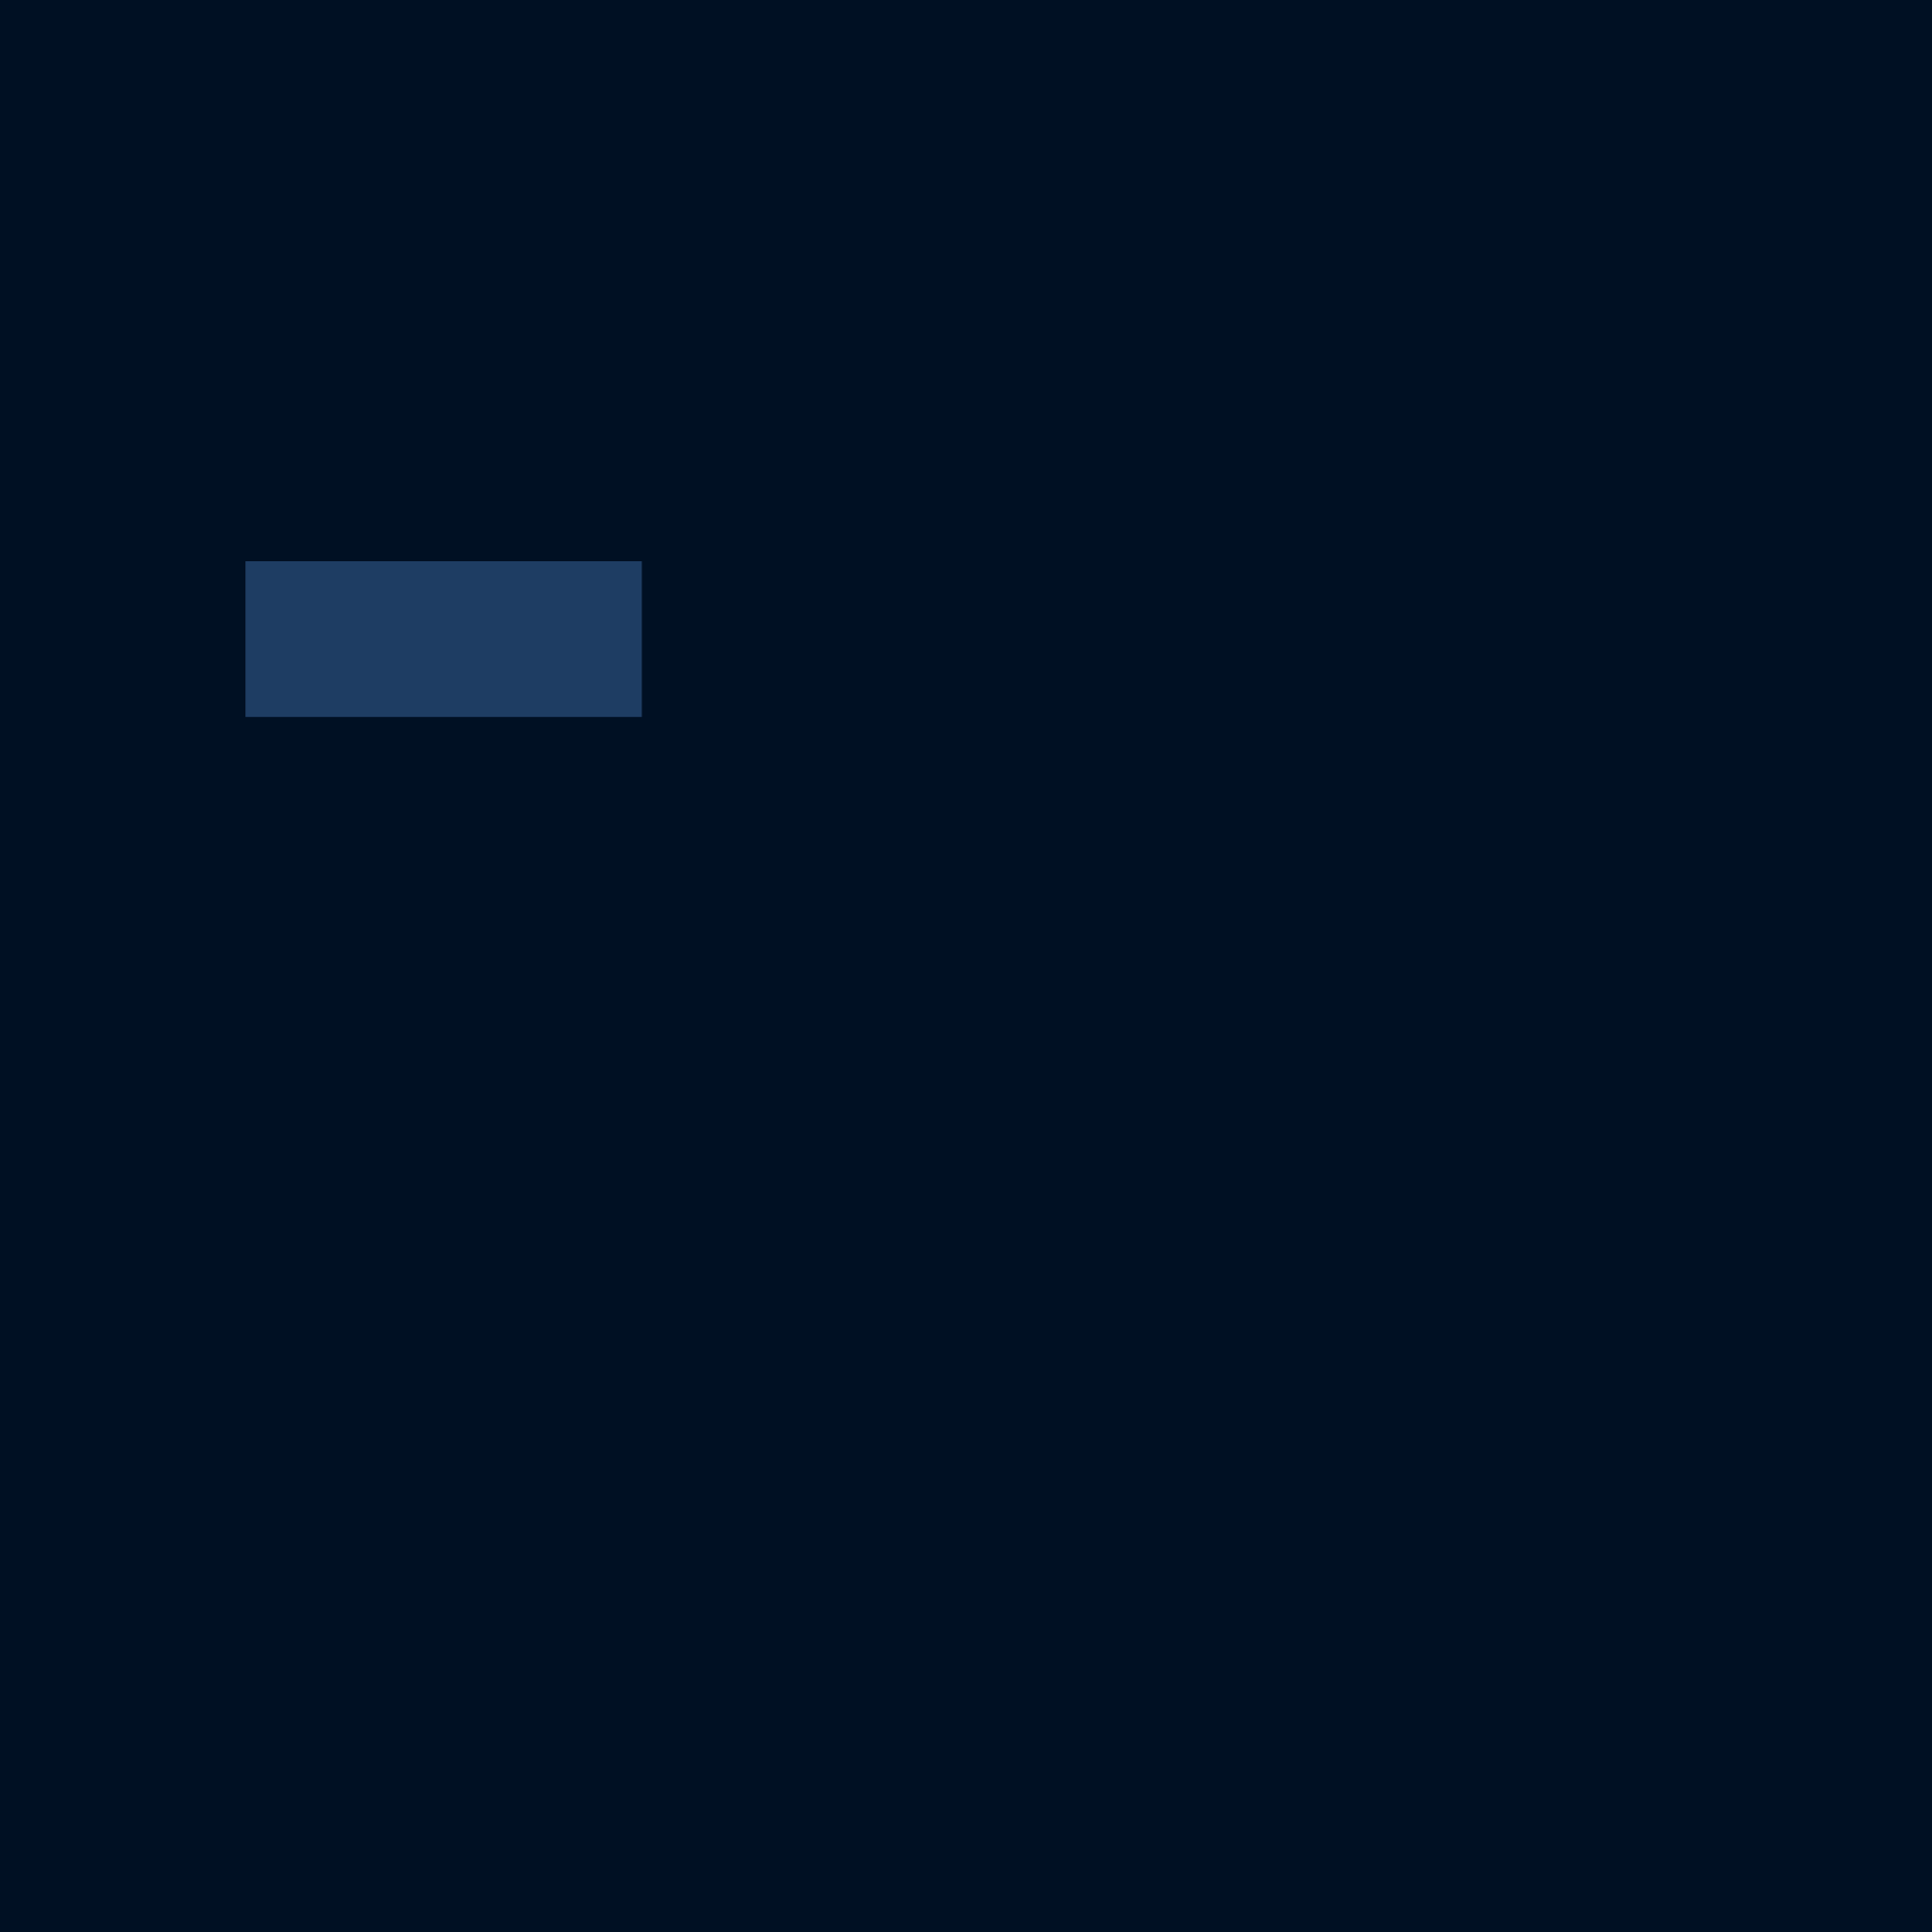
[diagram p8: board, bottom side, seen from below]

No outline. copper layers: Top Layer, Bottom Layer. Coordinates in mm from the lowest, leftmost part position.
Stack: Top Layer 0.035mm / Dielectric1 1.51mm FR4 er 4.5 / Bottom Layer 0.035mm

## Design rules (mm)
template: JLCPCB Capability(Two Layers Board)
spacing copperThickness1oz (default): track to track 0.102, other pairs 0.152 to 0.3
spacing copperThickness2oz: track to track 0.203, other pairs 0.152 to 0.3
track width copperThickness1oz (default): min 0.127, default 0.254, max 2.54
track width copperThickness2oz: min 0.203, default 0.254, max 2.54
differential pair differentialPair (default): width min 0.127, default 0.254, max 2.54; gap min 0.152, default 0.152
via viaSize (default): diameter min 0.5, default 0.61, max 10; hole min 0.3, default 0.305, max 6.3

## Placement (name value [footprint] x y rotation side)

## Nets
As in the schematic.

## Copper pours and planes (outline as drawn; the poured copper is in the pictures)
(no net) on Bottom Layer: 67.45,-28.21 88.79,-28.21 88.79,-36.59 67.45,-36.59
